# EAGLE design All_in_one Starter Kit for Arduino_V1.0 (EAGLE 9.6.2)
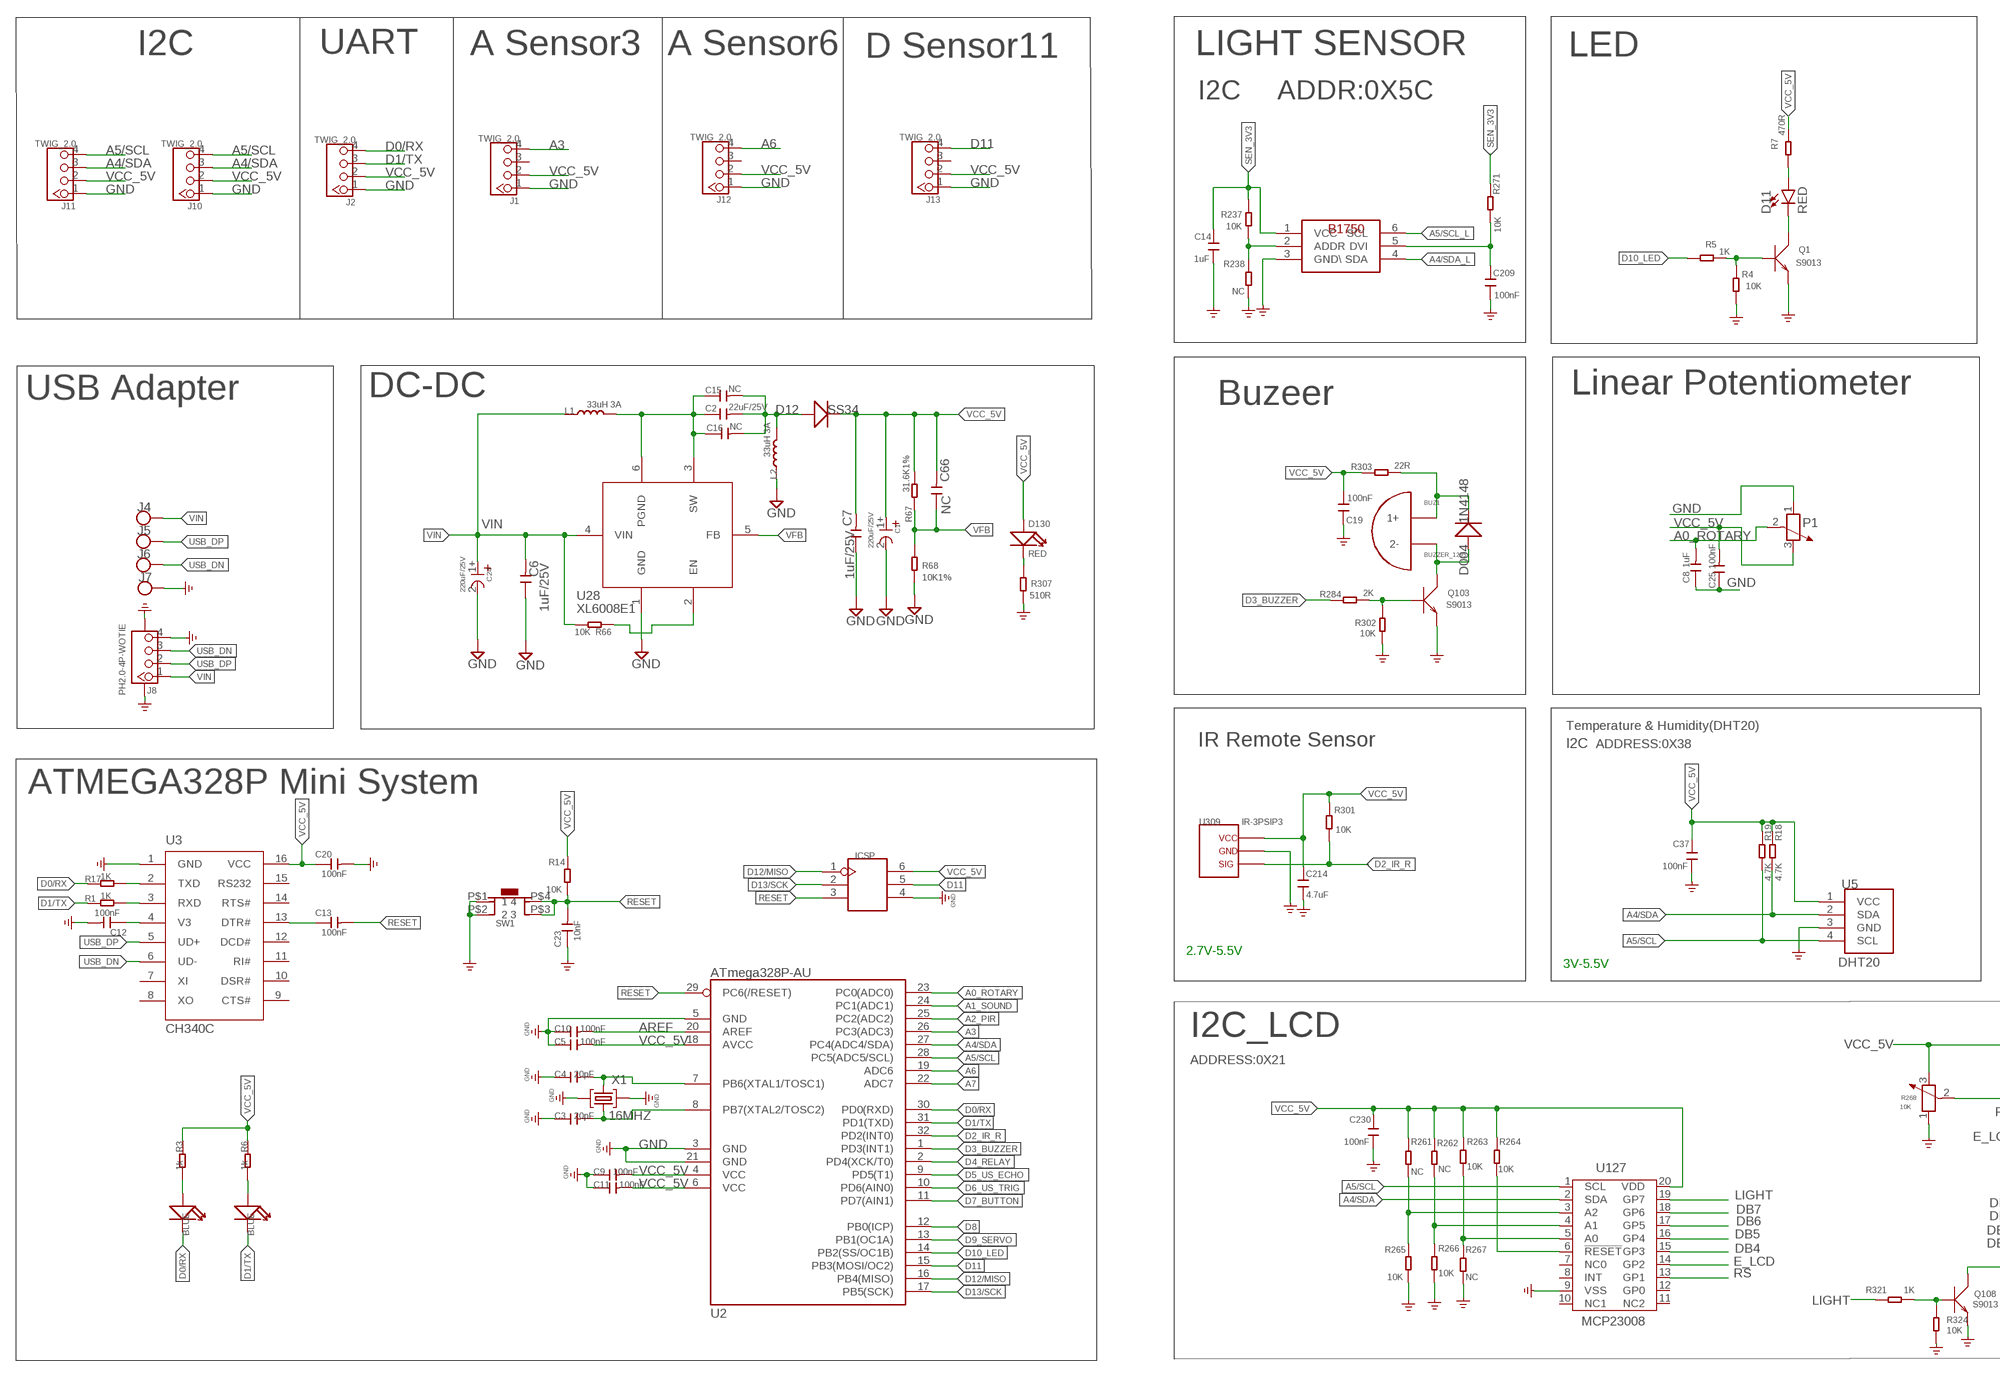
[diagram p0: schematic, sheet 1, part 1 of 2]
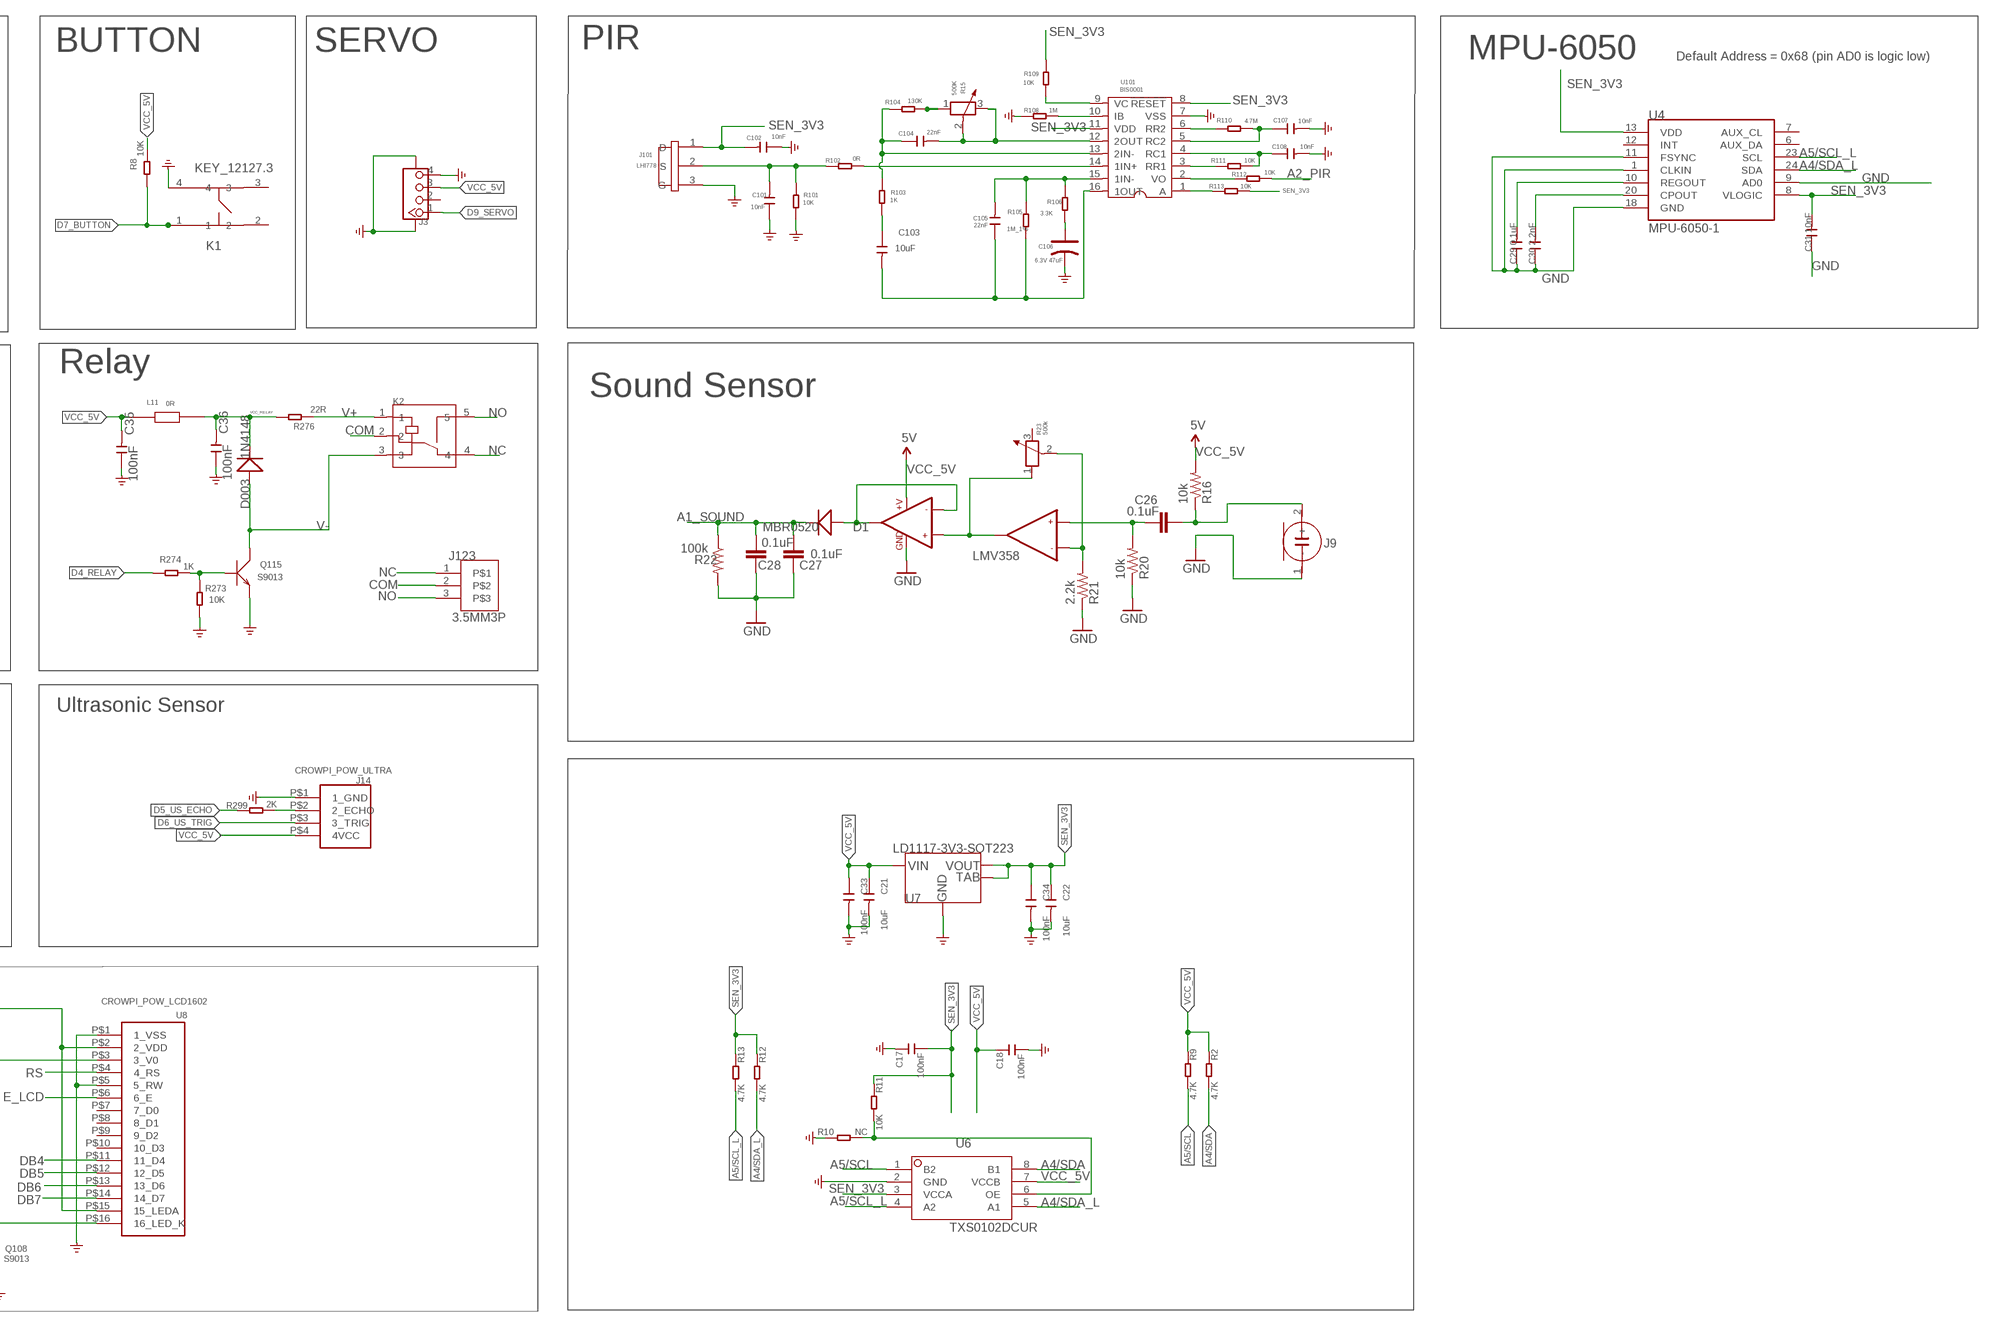
[diagram p1: schematic, sheet 1, part 2 of 2]

## Parts
BUZ1  BUZZER_1295  BUZZERBUZZER_1295_DIP  [BUZZER-D12MM-DIP2]
C1  220uF/25V  CAP_SMD_6.35.4MM  [CAP_SMD_6.3*5.4MM]
C2  22uF/25V  CAPC0805  [C0805]
C3  20pF  C-0603  [C0603]
C4  20pF  C-0603  [C0603]
C5  100nF  C-0603  [C0603]
C6  1uF/25V  C-0603  [C0603]
C7  1uF/25V  C-0603  [C0603]
C8  1uF  C-0603  [C0603]
C9  100nF  C-0603  [C0603]
C10  100nF  C-0603  [C0603]
C11  100nF  C-0603  [C0603]
C12  100nF  C0603  [C0603]
C13  100nF  C0603  [C0603]
C14  1uF  C0603  [0603]
C15  NC  CAPC0805  [C0805]
C16  NC  CAPC0805  [C0805]
C17  100nF  C0603  [0603]
C18  100nF  C0603  [0603]
C19  100nF  C0603  [0603]
C20  100nF  C0603  [C0603]
C21  10uF  CAP  [C0603]
C22  10uF  CAP  [C0603]
C23  10nF  C0603  [C0603]
C24  220uF/25V  CAP_SMD_6.35.4MM  [CAP_SMD_6.3*5.4MM]
C25  100nF  C-0603  [C0603]
C26  0.1uF  CAP0603-CAP  [0603-CAP]
C27  0.1uF  CAP0603-CAP  [0603-CAP]
C28  0.1uF  CAP0603-CAP  [0603-CAP]
C29  0.1uF  C-0603  [C0603]
C30  2.2nF  C-0603  [C0603]
C31  10nF  C-0603  [C0603]
C33  100nF  CAP  [C0603]
C34  100nF  CAP  [C0603]
C35  100nF  C-0603  [C0603]
C36  100nF  C-0603  [C0603]
C37  100nF  C0603  [0603]
C66  NC  C-0603  [C0603]
C101  10nF  C-0603  [C0603]
C102  10nF  C-0603  [C0603]
C103  10uF  C0603  [0603]
C104  22nF  C-0603  [C0603]
C105  22nF  C-0603  [C0603]
C106  6.3V 47uF  CAP-AVX-A  [AVX-A]
C107  10nF  C-0603  [C0603]
C108  10nF  C-0603  [C0603]
C209  100nF  C0603  [0603]
C214  4.7uF  C0603  [0603]
C230  100nF  C0603  [0603]
D1  MBR0520  D'MBR0520LT1'  [SOD123-2.7X1.6]
D003  1N4148  DIODE1206  [D_SOD123]
D004  1N4148  DIODE1206  [D_SOD123]
D11  RED  LED  [LED-8MM]
D12  SS34  DIODEB130L-13-F  [SMA]
D13  BLUE  LED'0603'  [LED-0603]
D14  BLUE  LED'0603'  [LED-0603]
D130  RED  LED_0603_SMT  [LED_0603_SMT]
ICSP  2.54-2x3p male  HEADER-2X3P-2.54  [2X3P-2.54]
J1  TWIG_2.0  [2.0_1X4]
J2  TWIG_2.0  [2.0_1X4]
J3  A_XBJ_CONNECTOR_TWIG-4P-2.0-SMD-FEMALE-REINFORCE90D  [A_XBJ_CONNECTOR_4P-SMD-2.0-90D]
J4  TP-SMDTP-SMD-2X4MM  [TP-SMD-2X4MM]
J5  TP-SMDTP-SMD-2X4MM  [TP-SMD-2X4MM]
J6  TP-SMDTP-SMD-2X4MM  [TP-SMD-2X4MM]
J7  TP-SMDTP-SMD-2X4MM  [TP-SMD-2X4MM]
J8  PH2.0-4P-WOTIE  [PH2.0-4P]
J9  TEMPLATE_MIC-6MM  [TEMPLATE_2P-D6MM]
J10  TWIG_2.0  [2.0_1X4]
J11  TWIG_2.0  [2.0_1X4]
J12  TWIG_2.0  [2.0_1X4]
J13  TWIG_2.0  [2.0_1X4]
J14  CROWPI_POW_ULTRA  [CROWPI_POW_ULTRA]
J101  LHI778  [3P-D8.1MM]
J123  3.5MM3P  [3.5MM*3P]
K1  KEY_12127.3  [KEY_12*12*7.3]
K2  RELAY-SRD  [REY5-6-19.1X15.5X15.3MM]
L1  33uH 3A  L  [L1040-SMD]
L2  33uH 3A  L  [L1040-SMD]
L11  0R  CMP201209UD1R0MT201209  [201209]
P1  R-POTENTIOMETER  [3P-SQUA-45.6X10X5.8H]
Q1  S9013  TRANSISTOR-NPN-SOT23  [SOT23@1]
Q103  S9013  TRANSISTOR-NPN-SOT23  [SOT23@1]
Q108  S9013  TRANSISTOR-NPN-SOT23  [SOT23@1]
Q115  S9013  TRANSISTOR-NPN-SOT23  [SOT23@1]
R1  1K  R0603  [R0603]
R2  4.7K  R0603  [R0603]
R3  1k  R-0603  [R0603]
R4  10K  R-0603  [R0603]
R5  1K  R-0603  [R0603]
R6  1k  R-0603  [R0603]
R7  470R  R-0603  [R0603]
R8  10K  R-0603  [R0603]
R9  4.7K  R0603  [R0603]
R10  NC  R0603  [R0603]
R11  10K  R0603  [R0603]
R12  4.7K  R0603  [R0603]
R13  4.7K  R0603  [R0603]
R14  10K  R0603  [R0603]
R15  500K  R-POTENTIOMETER-SMD  [3P-SMD-SQUA-3.6X3.3]
R16  10k  RESISTOR0603-RES  [0603-RES]
R17  1K  R0603  [R0603]
R18  4.7K  R0603  [R0603]
R19  4.7K  R0603  [R0603]
R20  10k  RESISTOR0603-RES  [0603-RES]
R21  2.2k  RESISTOR0603-RES  [0603-RES]
R22  100k  RESISTOR0603-RES  [0603-RES]
R23  500k  R-POTENTIOMETER-SMD  [3P-SMD-SQUA-3.6X3.3]
R66  10K  R0603  [R0603]
R67  31.6K1%  R0603  [R0603]
R68  10K1%  R0603  [R0603]
R101  10K  R-0603  [R0603]
R102  0R  R-0603  [R0603]
R103  1K  R-0603  [R0603]
R104  130K  R-0603  [R0603]
R105  1M_1%  R-0603  [R0603]
R106  3.3K  R-0603  [R0603]
R108  1M  R-0603  [R0603]
R109  10K  R-0603  [R0603]
R110  4.7M  R-0603  [R0603]
R111  10K  R-0603  [R0603]
R112  10K  R-0603  [R0603]
R113  10K  R-0603  [R0603]
R237  10K  R0603  [R0603]
R238  NC  R0603  [R0603]
R261  NC  R0603  [R0603]
R262  NC  R0603  [R0603]
R263  10K  R0603  [R0603]
R264  10K  R0603  [R0603]
R265  10K  R0603  [R0603]
R266  10K  R0603  [R0603]
R267  NC  R0603  [R0603]
R268  10K  R-POTENTIOMETER-SMD  [3P-SMD-SQUA-3.6X3.3]
R271  10K  R0603  [R0603]
R273  10K  R-0603  [R0603]
R274  1K  R-0603  [R0603]
R276  22R  R-0603  [R0603]
R284  2K  R0603  [R0603]
R299  2K  R0603  [R0603]
R301  10K  R0603  [R0603]
R302  10K  R0603  [R0603]
R303  22R  R0603  [R0603]
R307  510R  R0603  [R0603]
R321  1K  R0603  [R0603]
R324  10K  R0603  [R0603]
SW1  BUTTON-4P-SMD4.2X3.2  [BUTTON-SMD4P-4.2X3.2X2.5]
U1  LMV358  [SO08]
U2  ATmega328P-AU  ATMEGA168  [TQFP32]
U3  CH340C  CH340G  [SOP-16]
U4  MPU-6050-1  [QFN-24-4MM2]
U5  DHT20  CROWTAIL-DHT20-V1.0-20211013_DHT20  [CROWTAIL-DHT20-V1.0-20211013_DHT20]
U6  TXS0102DCUR  [VSSOP-8]
U7  LD1117-3V3-SOT223  [SOT223]
U8  CROWPI_POW_LCD1602  [CROWPI_POW_LCD1206]
U28  XL6008E1  XL6008XL6008  [TO252-5]
U101  BIS0001  TM2291  [SOP16]
U121  BH1750  [BH1750-WSOF-6]
U127  MCP23008  [SSOP20]
U309  IR-3PSIP3  [VS1838B-SIP3]
X1  16MHZ  CRYSTAL-3.2-2.5  [CRYSTAL-3.2-2.5]

## Nets
A0_ROTARY: C8.2 P1.2 U2.23(PC0(ADC0))
A1_SOUND: C27.2 C28.2 D1.2(-) R22.1 U2.24(PC1(ADC1))
A2_PIR: R112.1 U2.25(PC2(ADC2))
A3: J1.4 U2.26(PC3(ADC3))
A4/SDA: J10.3 J11.3 R2.2 R18.2 U2.27(PC4(ADC4/SDA)) U5.2(SDA) U6.8(B1) U127.2(SDA)
A4/SDA_L: R12.2 U4.24(SDA) U6.5(A1) U121.4(SDA)
A5/SCL: J10.4 J11.4 R9.2 R19.2 U2.28(PC5(ADC5/SCL)) U5.4(SCL) U6.1(B2) U127.1(SCL)
A5/SCL_L: R13.2 U4.23(SCL) U6.4(A2) U121.6(SCL)
A6: J12.4 U2.19(ADC6)
A7: U2.22(ADC7)
AREF: C10.2 U2.20(AREF)
COM: J123.2 K2.2
D0/RX: D13.- J2.4 R17.1 U2.30(PD0(RXD))
D1/TX: D14.- J2.3 R1.1 U2.31(PD1(TXD))
D2_IR_R: R301.2 U2.32(PD2(INT0)) U309.3
D3_BUZZER: R284.1 U2.1(PD3(INT1))
D4_RELAY: R274.2 U2.2(PD4(XCK/T0))
D5_US_ECHO: R299.2 U2.9(PD5(T1))
D6_US_TRIG: J14.P$3(3_TRIG) U2.10(PD6(AIN0))
D7_BUTTON: K1.1 R8.2 U2.11(PD7(AIN1))
D8: U2.12(PB0(ICP))
D9_SERVO: J3.1 U2.13(PB1(OC1A))
D10_LED: R5.2 U2.14(PB2(SS/OC1B))
D11: ICSP.5 J13.4 U2.15(PB3(MOSI/OC2))
D12/MISO: ICSP.1 U2.16(PB4(MISO))
D13/SCK: ICSP.2 U2.17(PB5(SCK))
DB4: U8.P$11(11_D4) U127.15(GP3)
DB5: U8.P$12(12_D5) U127.16(GP4)
DB6: U8.P$13(13_D6) U127.17(GP5)
DB7: U8.P$14(14_D7) U127.18(GP6)
E_LCD: U8.P$6(6_E) U127.14(GP2)
GND: C1.2- C3.1 C4.1 C5.1 C6.1 C7.1 C8.1 C9.1 C10.1 C11.1 C12.2 C14.1 C17.2 C18.1 C19.2 C20.2 C21.2 C22.2 C23.1 C24.2- C25.1 C27.1 C28.1 C29.1 C30.1 C31.1 C33.2 C34.2 C35.1 C36.1 C37.1 C101.1 C102.1 C106.- C107.2 C108.2 C209.1 C214.1 C230.1 ICSP.4 J1.1 J2.1 J3.4 J3.SS1 J3.SS2 J7.1 J8.4 J8.5(SS1) J8.6(SS2) J9.1(-) J10.1 J11.1 J12.1 J13.1 J14.P$1(1_GND) J101.3(G) K1.4 L2.1 P1.1 Q1.2(E) Q103.2(E) Q108.2(E) Q115.2(E) R4.1 R10.1 R20.1 R21.1 R22.2 R68.2 R101.1 R108.1 R238.1 R265.2 R266.2 R267.1 R268.1 R273.1 R302.1 R307.2 R324.2 SW1.P$1 SW1.P$2 U1.4(GND) U2.3(GND) U2.5(GND) U2.21(GND) U3.1(GND) U4.1(CLKIN) U4.9(AD0) U4.11(FSYNC) U4.18(GND) U5.3(GND) U6.2(GND) U7.1(GND) U8.P$1(1_VSS) U8.P$5(5_RW) U28.1(GND) U101.7(VSS) U121.3(GND\) U127.9(VSS) U309.2 X1.2(GND) X1.4(GND) ; supply symbol labelled POWER-OR-GND-_GND_POWER
LIGHT: R321.2 U127.19(GP7)
N$1: R111.1 U101.3(RR1)
N$2: Q108.1(B) R321.1 R324.1
N$3: R261.1 R265.1 U127.3(A2)
N$4: R262.1 R266.1 U127.4(A1)
N$5: R263.2 R267.2 U127.5(A0)
N$6: R264.2 U127.6(!RESET)
N$7: R268.2 U8.P$3(3_V0)
N$8: D13.+ R3.2
N$9: C12.1 U3.4(V3)
N$10: C13.1 U3.13(DTR#)
N$11: C4.2 U2.7(PB6(XTAL1/TOSC1)) X1.3(C2)
N$12: C3.2 U2.8(PB7(XTAL2/TOSC2)) X1.1(C1)
N$13: C108.1 R111.2 U101.4(RC1)
N$14: Q1.1(B) R4.2 R5.1
N$15: D11.2(C) Q1.3(C)
N$16: D11.1(A) R7.2
N$17: D14.+ R6.2
N$18: R66.1 U28.2(EN)
N$19: C2.2 C15.2 C16.2 D12.2(+) L2.2
N$20: Q108.3(C) U8.P$16(16_LED_K)
N$21: R112.2 U101.2(VO)
N$22: R17.2 U3.2(TXD)
N$23: R1.2 U3.3(RXD)
N$24: R10.2 R11.2 U6.6(OE)
N$25: R110.2 U101.6(RR2)
N$26: C107.1 R110.1 U101.5(RC2)
N$27: C104.2 R15.2 R15.3 U101.12(2OUT)
N$28: C104.1 R103.2 R104.2 U101.13(2IN-)
N$29: R109.2 U101.9(VC)
N$30: R108.2 U101.10(IB)
N$31: C101.2 J101.2(S) R101.2 R102.2
N$32: C103.2 C105.1 R105.1 U101.16(1OUT)
N$33: C105.2 R105.2 R106.2 U101.15(1IN-)
N$34: C209.2 R271.2 U121.5(DVI)
N$35: C103.1 R103.1
N$36: C106.+ R106.1
N$37: R113.2 U101.1(A)
N$38: R102.1 U101.14(1IN+)
N$39: R15.1 R104.1
N$40: C26.1 J9.2(+) R16.1
N$41: C26.2 R20.2 U1.5(+IN2)
N$42: R21.2 R23.2 U1.6(-IN2)
N$43: D1.1(+) U1.1(OUT1) U1.2(-IN1)
N$44: R23.1 U1.3(+IN1) U1.7(OUT2)
N$45: C29.2 U4.10(REGOUT)
N$46: C30.2 U4.20(CPOUT)
N$65: D130.2(2_K) R307.1
N$204: C2.1 C15.1 C16.1 L1.2 U28.3(SW) U28.6(PGND)
N$258: R237.1 R238.2 U121.2(ADDR)
N$259: Q115.1(B) R273.2 R274.1
N$278: J14.P$2(2_ECHO) R299.1
N$279: Q103.1(B) R284.2 R302.2
N$280: BUZ1.2(2-) D004.+ Q103.3(C)
N$281: BUZ1.1(1+) D004.- R303.2
NC: J123.1 K2.4
NO: J123.3 K2.5
RESET: C13.2 C23.2 ICSP.3 R14.2 SW1.P$3 SW1.P$4 U2.29(PC6(/RESET))
RS: U8.P$4(4_RS) U127.13(GP1)
SEN_3V3: C14.2 C17.1 C22.1 C31.2 C34.1 C102.2 J101.1(D) R11.1 R12.1 R13.1 R109.1 R113.1 R237.2 R271.1 U4.8(VLOGIC) U4.13(VDD) U6.3(VCCA) U7.2(VOUT) U7.4(TAB) U101.8(!RESET) U101.11(VDD) U121.1(VCC)
USB_DN: J6.1 J8.3 U3.6(UD-)
USB_DP: J5.1 J8.2 U3.5(UD+)
V+: K2.1 R276.2
V-: D003.+ K2.3 Q115.3(C)
VCC_5V: C1.1+ C5.2 C7.2 C9.2 C11.2 C18.2 C19.1 C20.1 C21.1 C25.2 C33.1 C35.2 C37.2 C66.2 C214.2 C230.2 D12.1(-) D130.1(1_A) ICSP.6 J1.2 J2.2 J3.3 J10.2 J11.2 J12.2 J13.2 J14.P$4(4VCC) L11.1 P1.3 R2.1 R3.1 R6.1 R7.1 R8.1 R9.1 R14.1 R16.2 R18.1 R19.1 R67.1 R261.2 R262.2 R263.1 R264.1 R268.3 R301.1 R303.1 U1.8(+V) U2.4(VCC) U2.6(VCC) U2.18(AVCC) U3.16(VCC) U5.1(VCC) U6.7(VCCB) U7.3(VIN) U8.P$2(2_VDD) U8.P$15(15_LEDA) U127.20(VDD) U309.1 ; supply symbol labelled 5V
VCC_RELAY: C36.2 D003.- L11.2 R276.1
VFB: C66.1 R67.2 R68.1 U28.5(FB)
VIN: C6.2 C24.1+ J4.1 J8.1 L1.1 R66.2 U28.4(VIN)
Unconnected: J1.3 J3.2 J12.3 J13.3 K1.2 K1.3 R23.3 U3.7(XI) U3.8(XO) U3.9(CTS#) U3.10(DSR#) U3.11(RI#) U3.12(DCD#) U3.14(RTS#) U3.15(RS232) U4.6(AUX_DA) U4.7(AUX_CL) U4.12(INT) U8.P$7(7_D0) U8.P$8(8_D1) U8.P$9(9_D2) U8.P$10(10_D3) U127.7(NC0) U127.8(INT) U127.10(NC1) U127.11(NC2) U127.12(GP0)

## Notes on the sheet
- I2C | UART | A Sensor3 | A Sensor6 | D Sensor11 | LIGHT SENSOR | LED | BUTTON | SERVO | PIR | MPU-6050
- Default Address = 0x68 (pin AD0 is logic low)
- I2C | ADDR:0X5C
- DC-DC | Linear Potentiometer | Relay
- USB Adapter | Buzeer
- Sound Sensor
- LMV358
- Temperature & Humidity(DHT20)
- Ultrasonic Sensor
- IR Remote Sensor | I2C | ADDRESS:0X38
- ATMEGA328P Mini System
- 2.7V-5.5V
- 3V-5.5V
- I2C_LCD
- ADDRESS:0X21

## Library data of the parts
BUZ1 = Crowtail_Starter:BUZZER
C1 C24 = Crowtail_Starter:CAP_SMD_6.3*5.4MM
C2 C15 C16 = CrowPanel_Advance_HMI:CAP*
C3-C5 C8-C11 C25 C29-C31 C35 C36 C101 C102 C104 C105 C107 C108 = Discrete:C*: Ceramic Capacitors
C6 C7 C66 = discrete:C*: Ceramic Capacitors
C12 C13 C20 C23 = Lora_Basic_Gateway_ Module:C0603
C14 C17-C19 C37 C209 C214 C230 = cooper:C0603
C21 C22 C33 C34 = LoraWAN_Gateway_Mainboard:CAP*
C26-C28 = SparkFun:CAP: Capacitor Standard 0603 ceramic capacitor, and 0.1" leaded capacitor.
C103 = A_xbj:C0603
C106 = Discrete:CAP*: Electrolytic Capacitors,Tantalum Capacitors and Super Capacitors
D1 = Discrete:D*
D003 D004 D12 = Crowtail_Starter:DIODE*
D11 = Crowtail_Starter:LED: LED (Generic) Standard schematic elements and footprints for 5mm, 3mm, 1206, and 0603 sized LEDs. Generic LEDs with no color specified.
D13 D14 = Discrete:LED*
D130 = cooper:LED_0603_SMT
ICSP = Connector:HEADER-2X3P
J1 J2 J10-J13 = CONNECTER:TWIG_2.0
J3 = CrowPanel ESP32 Display-4.3-inch-V2.1-20240314:A_XBJ_CONNECTOR_TWIG-4P-2.0-SMD-FEMALE-REINFORCE
J4-J7 = Crowtail_Starter:TP-SMD
J8 = CrowPanel ESP32 Display-4.3-inch-V2.1-20240314:PH2.0-4P-WOTIE
J9 = Crowtail- Sound Sensor-V2.0-20190717-01:TEMPLATE_MIC-6MM
J14 = Crowtail_Starter_V0.2:CROWPI_POW_ULTRA
J101 = PIR_motion_sensor:LHI778: Pyroelectric Infrared Detectors
J123 = Crowtail_Starter:3.5MM*3P
K1 = WGH:KEY_12*12*7.3
K2 = Discrete-new:RELAY-SRD
L1 L2 = Crowtail_Starter:L*
L11 = CrowPi2-MB-V1.4-20211012:CMP201209UD1R0MT
P1 R15 R23 R268 = Discrete:R-POTENTIOMETER*: Potentiometer
Q1 Q103 Q108 Q115 = Discrete:TRANSISTOR-NPN*: NPN audion
R1 R17 = Lora_Basic_Gateway_ Module:R0603
R2 R9-R14 R18 R19 R66-R68 R237 R238 R261-R267 R271 R284 R299 R301-R303 R307 R321 R324 = cooper:R0603
R3-R8 R101-R106 R108-R113 R273 R274 R276 = Discrete:R*
R16 R20-R22 = SparkFun:RESISTOR: Resistor Basic schematic elements and footprints for 0603, 1206, and PTH resistors.
SW1 = LoraWAN_Gateway_Mainboard:BUTTON-4P-SMD4.2X3.2
U1 = SparkFun:LMV358
U2 = IC:ATMEGA168
U3 = Lora_Basic_Gateway_ Module:CH340G
U4 = Testing:MPU-6050
U5 = Crowtail_Starter:CROWTAIL-DHT20-V1.0-20211013_DHT20
U6 = WGH:TXS0102DCUR
U7 = Lora_Basic_Gateway_ Module:LD1117-3V3-SOT223
U8 = Crowtail_Starter_V0.2:CROWPI_POW_LCD1602
U28 = Crowtail_Starter:XL6008
U101 = PIR_motion_sensor:TM2291: Infrared signal processor
U121 = Crowtail_Starter:BH1750
U127 = IC:MCP23008
U309 = Crowtail_Starter:IR-3P
X1 = SmartPrj:CRYSTAL-3.2-2.5

## Net classes
0 default: width 0.254 mm, drill 0.3 mm, clearance 0.152 mm

## Board
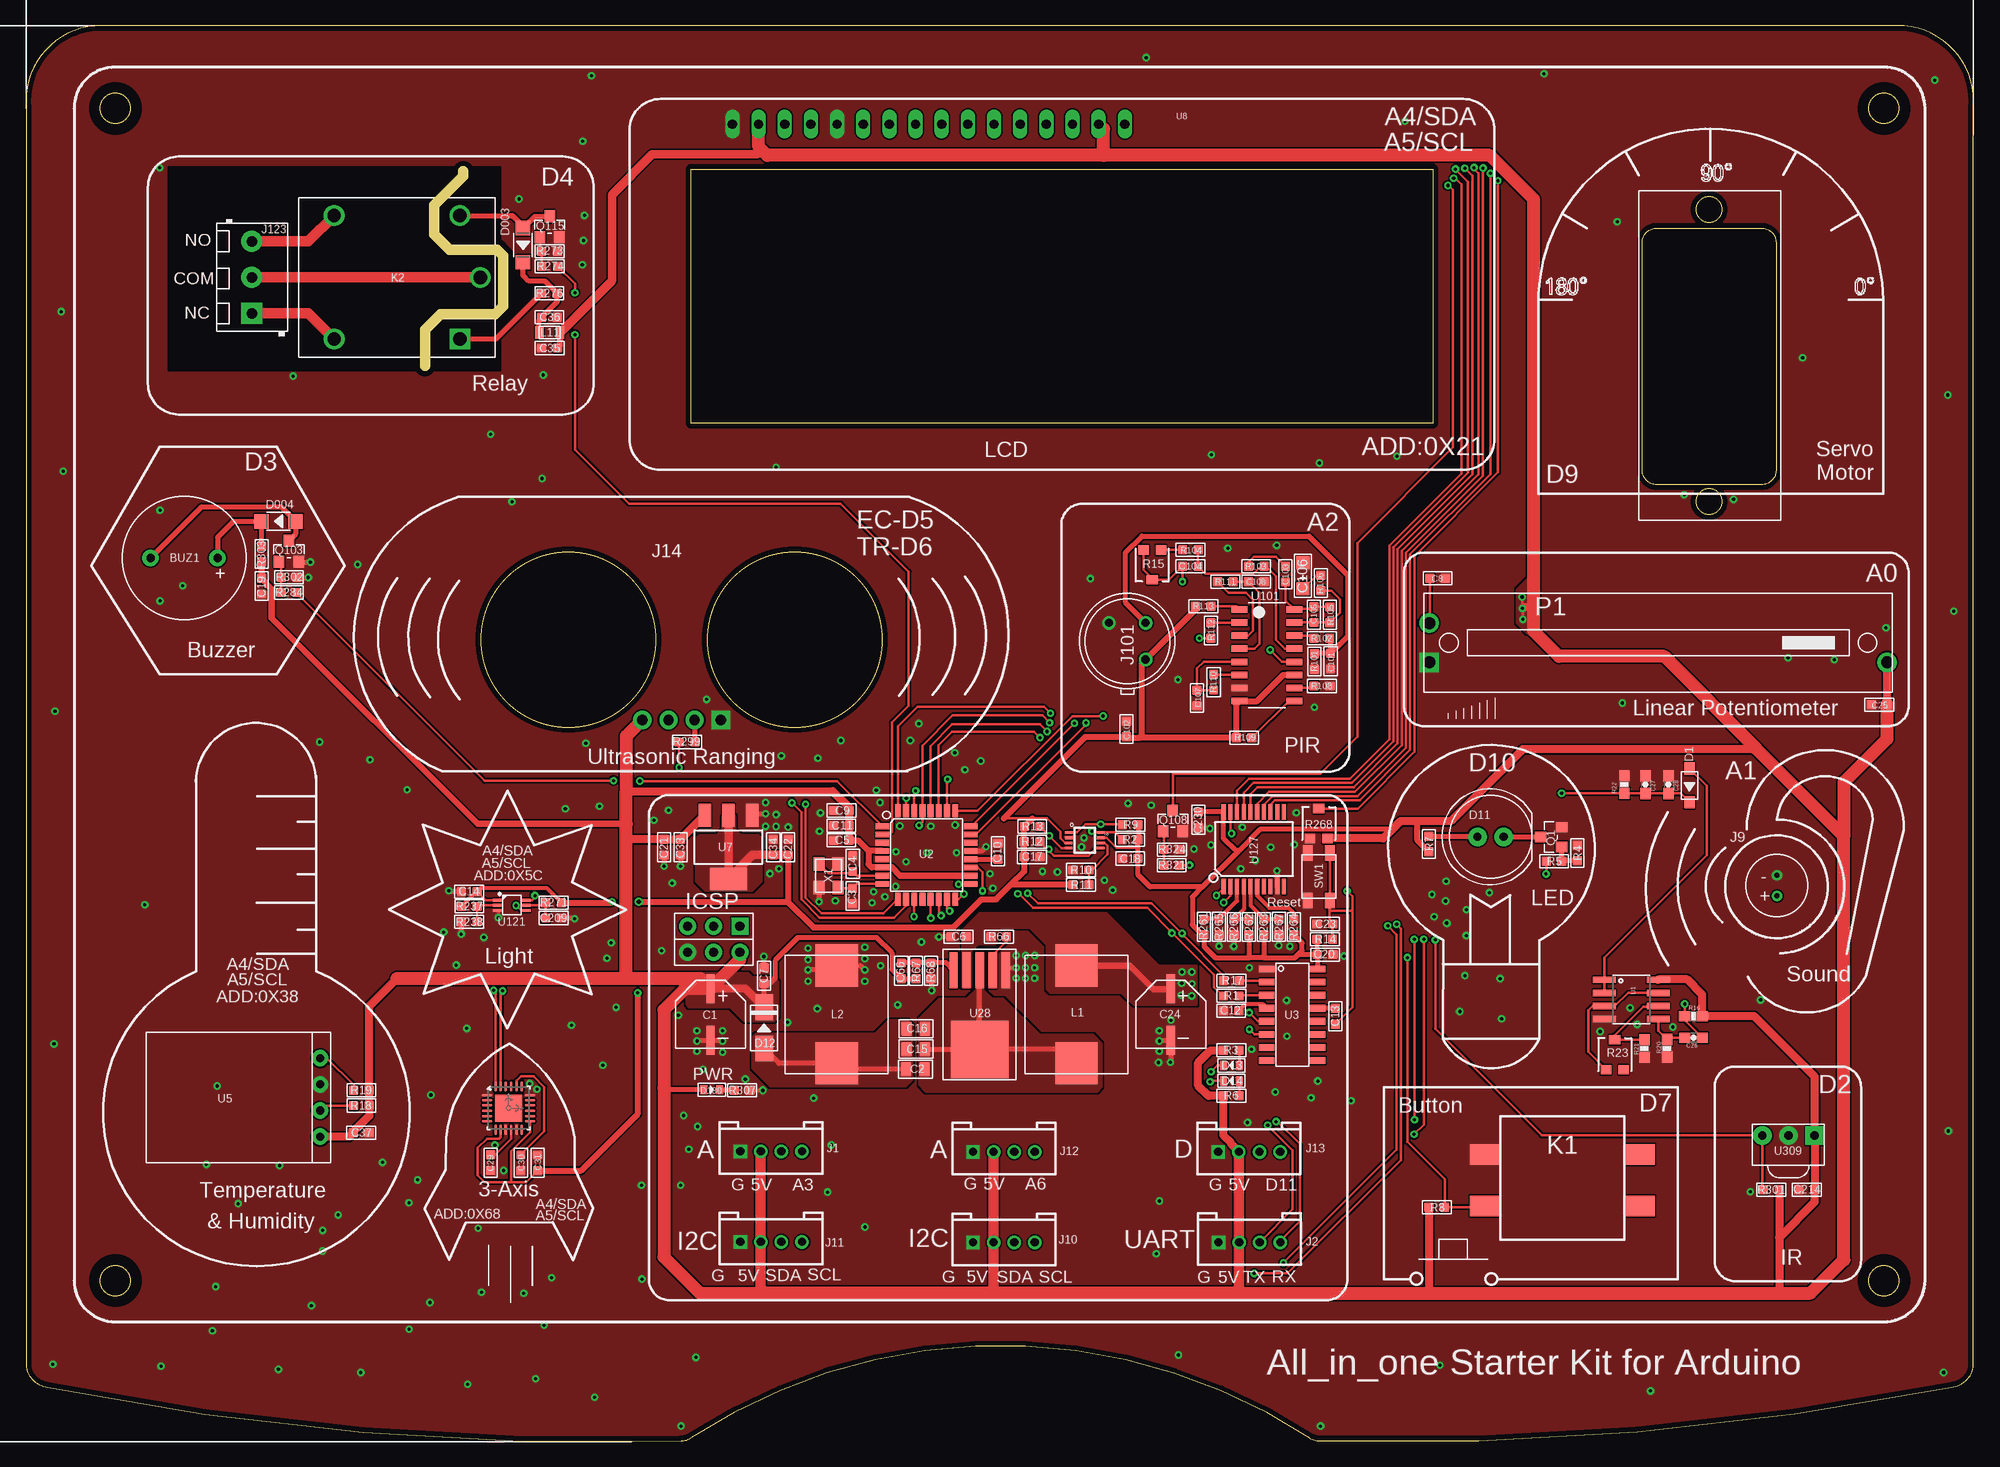
[diagram p2: board, top side]
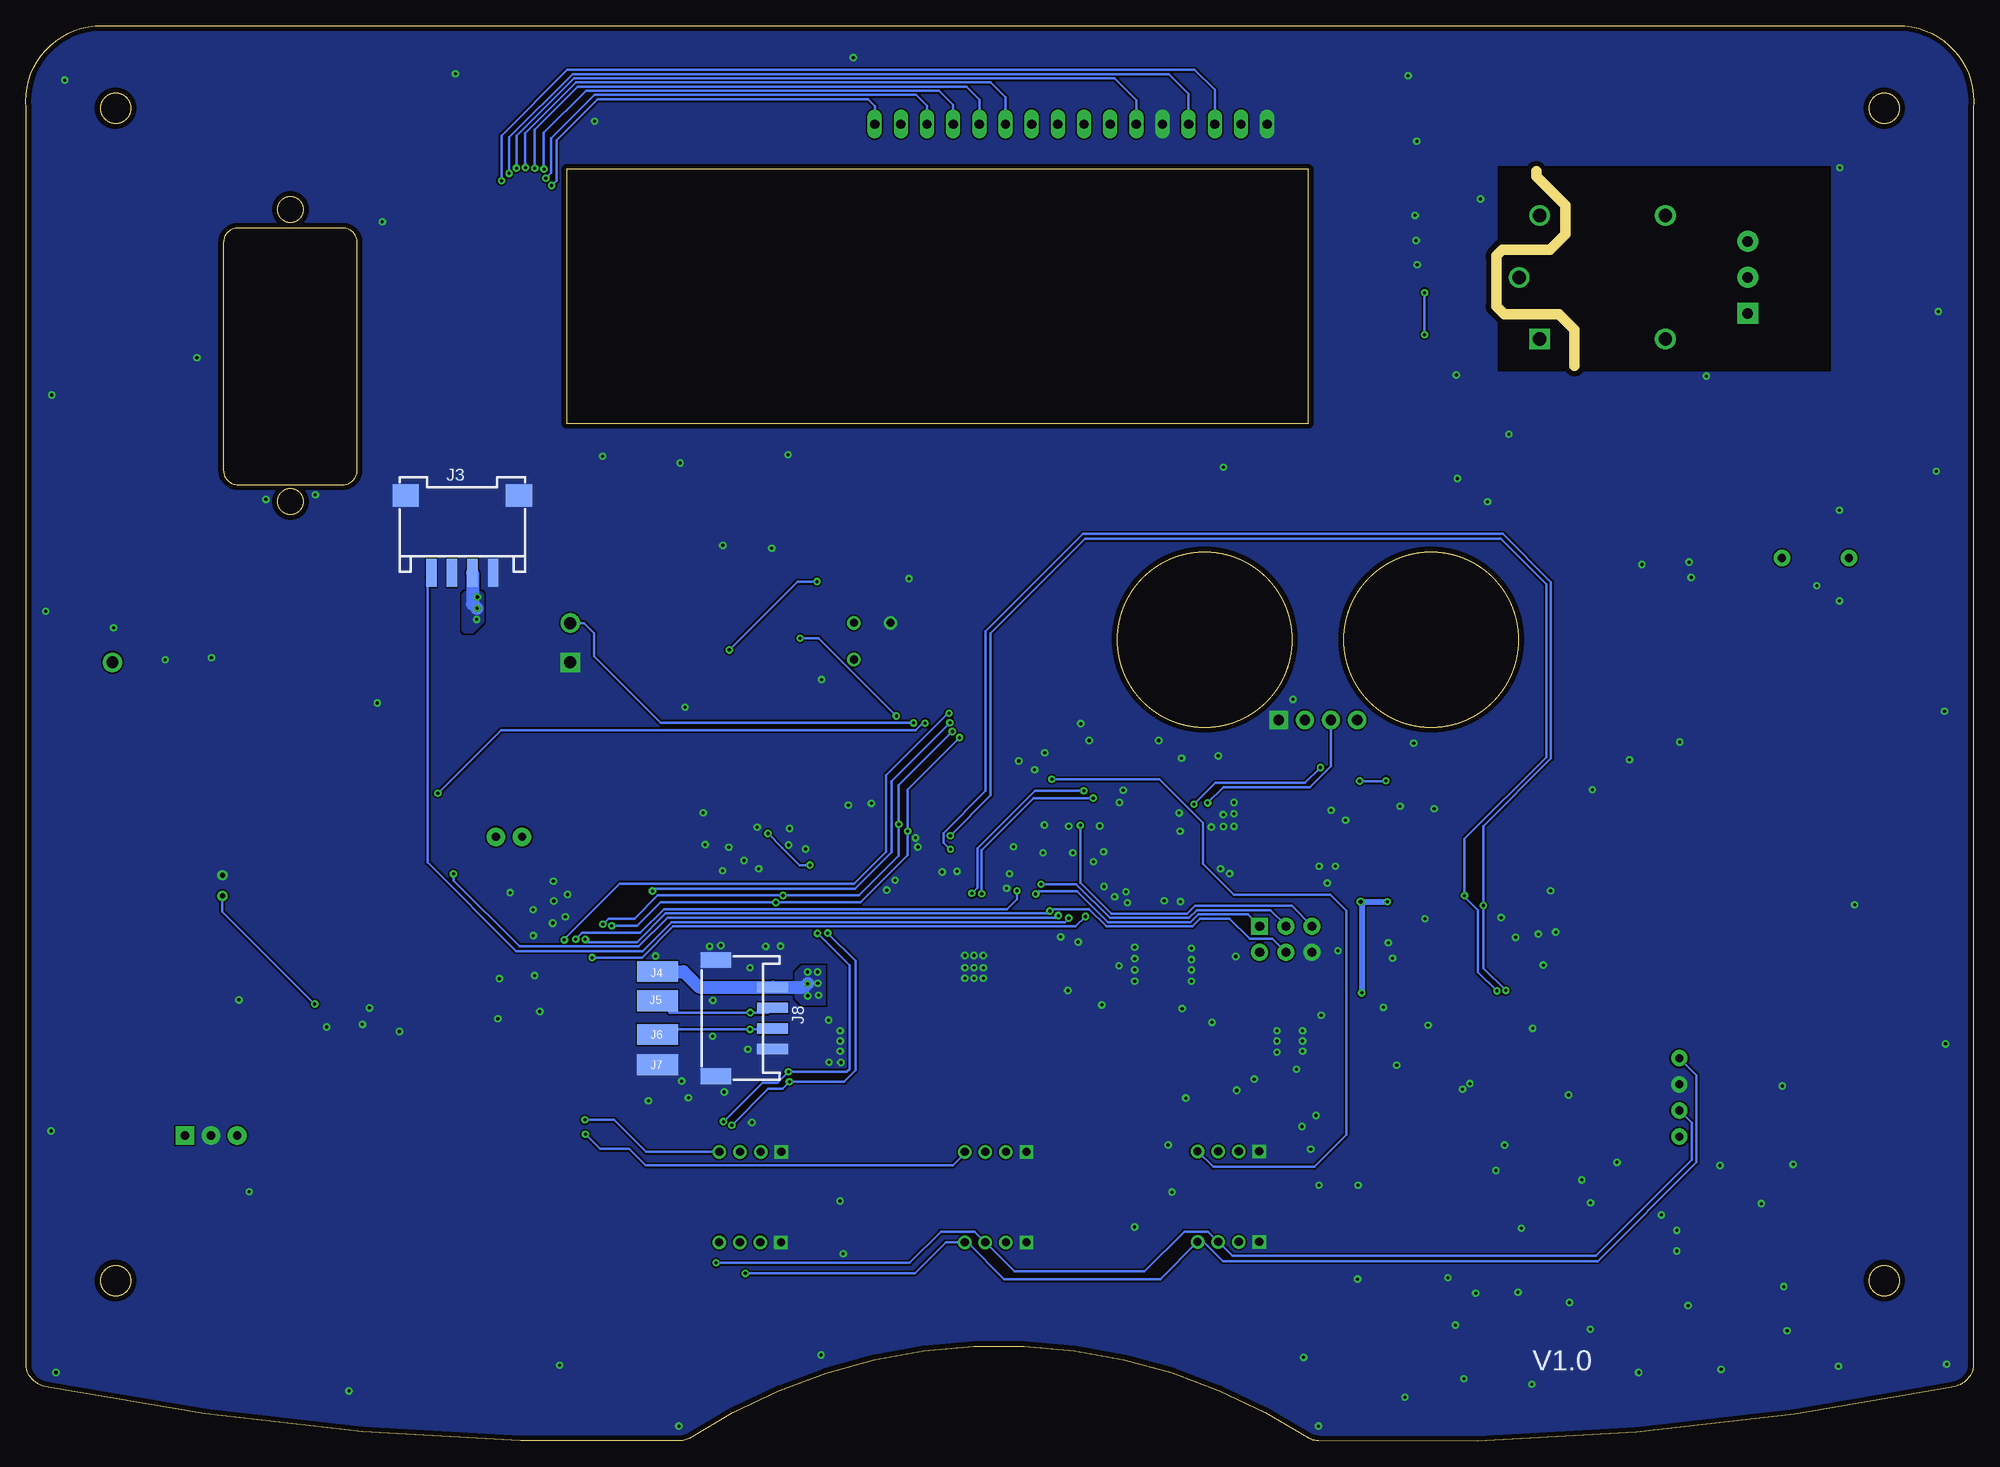
[diagram p3: board, bottom side, seen from below]

Size 189.18 x 137.4 mm. Coordinates in mm from the lower left corner, seen from the top.
Outline: 38.78,104.37 38.78,107.87 40.28,109.37 45.48,109.37
Outline: 46.38,115.07 45.78,115.67 41.18,115.67 39.68,117.17 39.68,119.97 42.48,122.77 42.48,123.27
Outline: 46.38,114.97 46.38,110.17 45.58,109.37
Outline: 189.15,7.17 189.15,129.4 arc90 182.45,137.4 6.69,137.4 arc90 0.03,129.4 0.03,7.17 arc74 2.16,5.24 arc13 63.64,0.02 arc30 64.63,0.3 arc-66 124.69,0.28 arc30 125.69,0.02 arc13 186.99,5.24 arc74 189.15,7.17
Outline: 169.98,116.35 169.98,94.25 arc-90 168.58,92.85 158.38,92.85 arc-90 156.98,94.25 156.98,116.35 arc-90 158.38,117.75 168.58,117.75 arc-90 169.98,116.35
Outline: circle at 8.69,15.58 radius 1.45
Outline: circle at 8.69,129.39 radius 1.45
Outline: circle at 180.45,15.58 radius 1.45
Outline: circle at 180.45,129.39 radius 1.45
Outline: circle at 163.48,91.2 radius 1.25
Outline: circle at 163.48,119.56 radius 1.25
Copper layers (1*16): Top 0.035mm / dielectric 1.5mm / Bottom 0.035mm
Design rules "default *": minimum track width 6mil, minimum drill 0.3mm, track to track 6mil, track to pad 6mil, pad to pad 6mil, via to via 6mil, smd to smd 6mil, copper to edge 20mil, drill to drill 6mil, minimum pad ring 10mil, minimum via ring 8mil, stop-mask expansion 4mil, vias tented up to drill 100mil, thermal gap 10mil
tKeepout: area 146.8,94 to 180.4,127.6
tRestrict: area 6.2,13.1 to 11.2,18.1; area 6.2,126.9 to 11.2,131.9; area 177.9,13.1 to 182.9,18.1; area 177.9,126.9 to 182.9,131.9

### Footprints (pad centres in the part's own frame; a part is rotated, then mirrored left to right if it is on the bottom)
BUZZER-D12MM-DIP2 = drill 0.8 pad 1.6: 1 -3.25,0; 2 3.25,0
CAP_SMD_6.3*5.4MM = smd 0.8 x 2.8: 1+ 0,2.5; 2- 0,-2.5
C0805 = smd 1.016 x 1.397: 1 -0.889,0; 2 0.889,0
C0603 = smd 0.889 x 0.889: 1 -0.762,0; 2 0.762,0
0603 = smd 0.889 x 0.889: 1 -0.762,0; 2 0.762,0
0603-CAP = smd 1.1 x 1: 1 -0.85,0; 2 0.85,0
AVX-A = smd 1.27 x 1.27: + -1.27,0; - 1.27,0
SOD123-2.7X1.6 = smd 1.2 x 1.02: 1 -1.635,0; 2 1.635,0
D_SOD123 = smd 1.397 x 1.397: + -1.651,0; - 1.651,0
LED-8MM = drill 0.8 pad 1.8: 1 -1.27,0; 2 1.27,0
SMA = smd 2.5 x 1.7: 1 2,0; 2 -2,0
LED-0603 = smd 0.762 x 0.889: + -0.762,0; - 0.762,0
LED_0603_SMT = smd 0.762 x 0.889: 1 -0.762,0; 2 0.762,0
2X3P-2.54 = drill 0.889 pad 1.651 square: 1 -1.27,2.54 | drill 0.889 pad 1.651: 2 -1.27,0; 3 -1.27,-2.54; 4 1.27,-2.54; 5 1.27,0; 6 1.27,2.54
2.0_1X4 = drill 0.8 pad 1.27 square: 1 -3,0 | drill 0.8 pad 1.27: 2 -1,0; 3 1,0; 4 3,0
A_XBJ_CONNECTOR_4P-SMD-2.0-90D = smd 1.01 x 2.74: 1 -3,-0.1; 2 -1,-0.1; 3 1,-0.1; 4 3,-0.1 | smd 2.54 x 2.184: SS1 -5.5,7.4; SS2 5.5,7.4
TP-SMD-2X4MM = smd 4 x 2: 1 0,0
PH2.0-4P = smd 1 x 3: 1 -3,2.762; 2 -1,2.762; 3 1,2.762; 4 3,2.762 | smd 1.524 x 3: 5 -5.65,-2.763; 6 5.65,-2.763
TEMPLATE_2P-D6MM = drill 0.5 pad 0.9: 1 0,1; 2 0,-1
CROWPI_POW_ULTRA = drill 1 pad 1.778 square: P$1 3.81,0 | drill 1 pad 1.778: P$2 1.27,0; P$3 -1.27,0; P$4 -3.81,0
3P-D8.1MM = drill 0.8: 1 1.778,1.778; 2 -1.778,1.778; 3 -1.778,-1.778
3.5MM*3P = drill 1.016 pad 2.032 square: 1 -3.5,0 | drill 1.016 pad 2.032: 2 0,0; 3 3.5,0
KEY_12*12*7.3 = smd 3 x 2: 1 -7.5,-2.5; 2 7.5,-2.5; 3 7.5,2.5; 4 -7.5,2.5
REY5-6-19.1X15.5X15.3MM = drill 1.3 pad 2 square: 1 -6.1,6 | drill 1.3 pad 2: 2 -8.1,0; 3 -6.1,-6; 4 6.1,6; 5 6.1,-6
L1040-SMD = smd 4.1 x 4.1: 1 -4.75,0; 2 4.75,0
201209 = smd 0.8 x 1.2: 1 -1,0; 2 1,0
3P-SQUA-45.6X10X5.8H = drill 1.143 pad 1.905 square: 1 -22.225,-1.905 | drill 1.143 pad 1.905: 2 -22.225,1.905; 3 22.225,-1.905
SOT23@1 = smd 1.016 x 1.143: 1 -0.95,-1.016; 2 0.95,-1.016; 3 0,1.016
R0603 = smd 0.889 x 0.889: 1 -0.762,0; 2 0.762,0
3P-SMD-SQUA-3.6X3.3 = smd 1 x 0.9: 1 -0.85,-1.45; 3 0.85,-1.45 | smd 1.1 x 0.9: 2 0,1.45
0603-RES = smd 1.1 x 1: 1 -0.85,0; 2 0.85,0
BUTTON-SMD4P-4.2X3.2X2.5 = smd 1.5 x 0.95: P$1 -2.3,1.075; P$2 2.3,1.075; P$3 -2.3,-1.075; P$4 2.3,-1.075
SO08 = smd 0.61 x 2.21: 1 -1.905,-2.616; 2 -0.635,-2.616; 3 0.635,-2.616; 4 1.905,-2.616; 5 1.905,2.616; 6 0.635,2.616; 7 -0.635,2.616; 8 -1.905,2.616
TQFP32 = smd 1.27 x 0.559: 1 -4.293,2.8; 2 -4.293,2; 3 -4.293,1.2; 4 -4.293,0.4; 5 -4.293,-0.4; 6 -4.293,-1.2; 7 -4.293,-2; 8 -4.293,-2.8; 17 4.293,-2.8; 18 4.293,-2; 19 4.293,-1.2; 20 4.293,-0.4; 21 4.293,0.4; 22 4.293,1.2; 23 4.293,2; 24 4.293,2.8 | smd 0.559 x 1.27: 9 -2.8,-4.293; 10 -2,-4.293; 11 -1.2,-4.293; 12 -0.4,-4.293; 13 0.4,-4.293; 14 1.2,-4.293; 15 2,-4.293; 16 2.8,-4.293; 25 2.8,4.293; 26 2,4.293; 27 1.2,4.293; 28 0.4,4.293; 29 -0.4,4.293; 30 -1.2,4.293; 31 -2,4.293; 32 -2.8,4.293
SOP-16 = smd 0.66 x 1.5: 1 -4.445,-2.475; 2 -3.175,-2.475; 3 -1.905,-2.475; 4 -0.635,-2.475; 5 0.635,-2.475; 6 1.905,-2.475; 7 3.175,-2.475; 8 4.445,-2.475; 9 4.445,2.475; 10 3.175,2.475; 11 1.905,2.475; 12 0.635,2.475; 13 -0.635,2.475; 14 -1.905,2.475; 15 -3.175,2.475; 16 -4.445,2.475
QFN-24-4MM2 = smd 1.016 x 0.254: 1 -2.066,1.257; 2 -2.066,0.75; 3 -2.066,0.247; 4 -2.066,-0.287; 5 -2.066,-0.792; 6 -2.066,-1.297; 13 2.086,-1.297; 14 2.086,-0.792; 15 2.086,-0.287; 16 2.086,0.247; 17 2.086,0.75; 18 2.086,1.257 | smd 0.254 x 1.016: 7 -1.267,-2.122; 8 -0.762,-2.122; 9 -0.258,-2.122; 10 0.278,-2.122; 11 0.78,-2.122; 12 1.287,-2.122; 19 1.287,2.082; 20 0.78,2.082; 21 0.278,2.082; 22 -0.258,2.082; 23 -0.762,2.082; 24 -1.267,2.082 | smd 2.616 x 2.616: P$1 0.02,-0.01
CROWTAIL-DHT20-V1.0-20211013_DHT20 = drill 0.8 pad 1.6: 1 -3.81,0; 2 -1.27,0; 3 1.27,0; 4 3.81,0
VSSOP-8 = smd 0.25 x 0.7: 1 -0.762,-1.55; 2 -0.254,-1.55; 3 0.254,-1.55; 4 0.762,-1.55; 5 0.762,1.55; 6 0.254,1.55; 7 -0.254,1.55; 8 -0.762,1.55
SOT223 = smd 1.219 x 2.235: 1 -2.311,-3.099; 2 0,-3.099; 3 2.311,-3.099 | smd 3.6 x 2.2: 4 0,3.099
CROWPI_POW_LCD1206 = drill 0.9 long: P$1 -16.51,3.36; P$2 -13.97,3.36; P$3 -11.43,3.36; P$4 -8.89,3.36; P$5 -6.35,3.36; P$6 -3.81,3.36; P$7 -1.27,3.36; P$8 1.27,3.36; P$9 3.81,3.36; P$10 6.35,3.36; P$11 8.89,3.36; P$12 11.43,3.36; P$13 13.97,3.36; P$14 16.51,3.36; P$15 19.05,3.36; P$16 21.59,3.36
TO252-5 = smd 3.5 x 0.8: 1 4.32,-2.53; 2 4.32,-1.26; 3 4.32,0.01; 4 4.32,1.28; 5 4.32,2.55 | smd 5.6 x 5.6: 6 -3.38,0.01
SOP16 = smd 0.635 x 1.524: 1 0,0; 2 1.27,0; 3 2.54,0; 4 3.81,0; 5 5.08,0; 6 6.35,0; 7 7.62,0; 8 8.89,0; 9 8.89,5.334; 10 7.62,5.334; 11 6.35,5.334; 12 5.08,5.334; 13 3.81,5.334; 14 2.54,5.334; 15 1.27,5.334; 16 0,5.334
BH1750-WSOF-6 = smd 0.8 x 0.27: 1 -1.4,0.5; 2 -1.4,0; 3 -1.4,-0.5; 4 1.4,-0.5; 5 1.4,0; 6 1.4,0.5
SSOP20 = smd 0.4 x 1.5: 1 -2.925,-3.625; 2 -2.275,-3.625; 3 -1.625,-3.625; 4 -0.975,-3.625; 5 -0.325,-3.625; 6 0.325,-3.625; 7 0.975,-3.625; 8 1.625,-3.625; 9 2.275,-3.625; 10 2.925,-3.625; 11 2.925,3.625; 12 2.275,3.625; 13 1.625,3.625; 14 0.975,3.625; 15 0.325,3.625; 16 -0.325,3.625; 17 -0.975,3.625; 18 -1.625,3.625; 19 -2.275,3.625; 20 -2.925,3.625
VS1838B-SIP3 = drill 0.8 pad 1.8 square: 1 -2.54,0 | drill 0.8 pad 1.8: 2 0,0; 3 2.54,0
CRYSTAL-3.2-2.5 = smd 1.3 x 1.05: 1 -1.15,-0.925; 2 1.15,-0.925; 3 1.15,0.925; 4 -1.15,0.925

### Placement (x,y rotation side)
BUZ1  15.38,85.73 180 top
C1  66.51,41.41 0 top
C2  86.39,36.09 180 top
C3  80.31,52.91 90 top
C4  80.32,56.06 270 top
C5  79.19,58.31 0 top
C6  90.6,48.96 0 top
C7  71.7,45.18 270 top
C8  137.11,83.78 180 top
C9  79.22,61.21 0 top
C10  94.43,57.26 270 top
C11  79.21,59.75 0 top
C12  117.07,41.78 180 top
C13  127.18,41.24 270 top
C14  43.07,53.34 0 top
C15  86.44,38.04 180 top
C16  86.44,40.02 180 top
C17  97.72,56.7 0 top
C18  107.26,56.55 0 top
C19  22.9,83 270 top
C20  126.19,47.23 0 top
C21  62,57.66 270 top
C22  74.05,57.66 90 top
C23  126.17,50.19 0 top
C24  111.2,41.41 0 top
C25  179.99,71.49 0 top
C26  161.96,39.15 180 top
C27  157.3,63.73 270 top
C28  159.53,63.73 270 top
C29  45.13,27.03 90 top
C30  48.08,27.01 90 top
C31  49.72,27.01 270 top
C33  63.61,57.66 270 top
C34  72.6,57.66 90 top
C35  50.87,106.12 0 top
C36  50.84,109.09 180 top
C37  32.57,29.94 180 top
C66  85.03,45.65 270 top
C101  126.73,75.71 90 top
C102  106.89,69.13 270 top
C103  122.34,84.16 270 top
C104  113.1,84.91 180 top
C105  125.11,80.23 270 top
C106  124.04,84 90 top
C107  113.75,72.14 270 top
C108  119.5,83.43 0 top
C209  51.27,50.78 180 top
C214  172.96,24.4 0 top
C230  113.87,60.3 90 top
D1  161.57,63.65 270 top
D003  48.29,116.1 270 top
D004  24.55,89.29 180 top
D11  142.25,58.66 0 top
D12  71.71,40.1 90 top
D13  117.09,36.46 180 top
D14  117.09,34.96 180 top
D130  66.62,34.09 0 top
ICSP  66.81,48.71 270 top
J1  72.38,28.13 0 top
J2  118.84,19.29 0 top
J3  146.79,84.39 0 bottom
J4  127.82,45.57 0 bottom
J5  127.82,42.74 0 bottom
J6  127.82,39.47 0 bottom
J7  127.82,36.53 0 bottom
J8  119.4,41.06 270 bottom
J9  170.06,53.93 0 top
J10  94.99,19.29 0 top
J11  72.38,19.34 0 top
J12  94.99,28.08 0 top
J13  118.81,28.08 0 top
J14  63.69,70 0 top
J101  106.97,77.66 270 top
J123  21.95,112.98 90 top
K1  KEY_1212*7.3  [KEY_12*12*7.3]  149.23,25.32 0 top
K2  36.05,112.98 180 top
L1  102.04,41.41 270 top
L2  78.76,41.41 270 top
L11  50.88,107.61 180 top
P1  158.52,77.5 0 top
Q1  148.13,58.64 90 top
Q103  25.56,86.39 0 top
Q108  111.4,60.2 0 top
Q115  50.88,117.89 0 top
R1  117.08,43.21 0 top
R2  107.25,58.37 180 top
R3  117.08,37.92 0 top
R4  150.68,57.1 270 top
R5  148.43,56.29 180 top
R6  117.08,33.51 0 top
R7  136.27,57.97 90 top
R8  137.03,22.7 0 top
R9  107.28,59.82 180 top
R10  102.47,55.44 0 top
R11  102.48,53.99 0 top
R12  97.72,58.18 0 top
R13  97.74,59.66 0 top
R14  126.16,48.71 0 top
R15  109.4,85.07 180 top
R16  161.96,41.24 0 top
R17  117.09,44.68 0 top
R18  32.59,32.57 180 top
R19  32.6,34.04 180 top
R20  159.38,38.12 90 top
R21  157.2,38.11 90 top
R22  155.25,63.74 90 top
R23  154.31,37.51 0 top
R66  94.51,48.96 180 top
R67  86.46,45.65 90 top
R68  87.9,45.65 270 top
R101  125.16,75.68 90 top
R102  125.87,77.94 0 top
R103  119.5,84.93 0 top
R104  113.12,86.52 0 top
R105  126.64,80.21 270 top
R106  125.76,83.3 270 top
R108  125.88,73.3 180 top
R109  118.33,68.26 0 top
R110  115.36,73.67 90 top
R111  116.5,83.43 0 top
R112  115.1,78.7 90 top
R113  114.37,81.03 0 top
R237  43.08,51.9 180 top
R238  43.05,50.4 0 top
R261  114.42,49.92 270 top
R262  118.79,49.9 270 top
R263  120.24,49.91 90 top
R264  123.16,49.91 90 top
R265  115.89,49.92 270 top
R266  117.34,49.91 270 top
R267  121.7,49.92 90 top
R268  125.56,59.95 0 top
R271  51.25,52.26 180 top
R273  50.86,115.53 180 top
R274  50.86,114.05 0 top
R276  50.85,111.44 180 top
R284  25.57,82.38 180 top
R299  64.22,67.86 180 top
R301  169.51,24.4 180 top
R302  25.57,83.85 180 top
R303  22.9,86.11 90 top
R307  69.58,34.06 0 top
R321  111.29,55.89 0 top
R324  111.31,57.42 0 top
SW1  125.57,54.8 90 top
U1  155.92,42.87 270 top
U2  87.48,56.89 0 top
U3  122.99,41.38 270 top
U4  46.88,32.33 0 top
U5  28.59,33.35 90 top
U6  102.85,58.32 270 top
U7  68.25,57.65 180 top
U8  85.14,124.49 0 top
U28  92.65,41.4 90 top
U101  117.87,80.73 270 top
U121  47.21,52.01 0 top
U127  119.26,57.46 0 top
U309  171.18,29.66 180 top
X1  77.96,54.88 90 top

### Tracks (layer width: path | path; a pad name or v marks a point on that pad's centre or on a via)
A0_ROTARY  (via drill 0.3)
  Top 0.254: C8.2 136.35,79.46 P1.2 | U2.23 92.29,58.89 102.95,69.55 v102.95,69.72
  Bottom 0.254: v102.95,69.72 127.51,69.72 133.98,76.19 133.98,78.42 134.97,79.41 P1.2
A1_SOUND  (via drill 0.3)
  Top 0.254: U2.24 91.86,59.69 101.84,69.67 v101.84,69.69 | D1.2 160.71,62.88 C28.2 C27.2 157.29,62.89 R22.1 v149.15,62.89
  Bottom 0.254: v101.84,69.69 102.08,69.69 102.75,69.02 142.99,69.02 149.1,62.91 149.13,62.91 v149.15,62.89
A2_PIR  (via drill 0.3)
  Top 0.254: U2.25 92.43,61.18 101.63,70.39 v104.63,70.39 | v113.98,77.94 R112.1
  Bottom 0.254: v104.63,70.39 112.18,77.94 v113.98,77.94
A3  (via drill 0.3)
  Top 0.254: U2.26 89.48,64.2 v89.53,64.25
  Bottom 0.254: v89.53,64.25 79.07,64.25 74.86,60.04 74.86,56.03 71.87,53.04 62.46,53.04 60.91,51.49 60.91,29.75 64.04,26.62 73.86,26.62 75.37,28.13 J1.4
A4/SDA  (via drill 0.3)
  Top 0.254: R2.2 105.78,59.08 U6.8 103.66,59.08 v103.53,59.21 | R18.2 29.08,32.57 U5.2 | U2.27 88.64,61.22 88.64,67.54 89.97,68.88 97.9,68.88 v98.49,68.29 | v116.34,52.29 116.99,52.94 U127.2 | v132.27,50.02 133.13,49.16 133.13,28.29 v122.14,17.3
  Bottom 0.254: v98.49,68.29 103.56,63.22 103.56,59.24 v103.53,59.21 103.53,56.87 108.11,52.29 v116.34,52.29 127.53,52.29 129.8,50.02 v132.27,50.02 | U5.2 27.39,30.88 27.39,27.31 36.72,17.97 71.99,17.97 73.35,19.34 J11.3 74.36,20.32 76.66,20.32 80.52,16.46 93.14,16.46 95.97,19.29 J10.3 97.04,20.34 100.31,20.34 103.35,17.3 v122.14,17.3
A4/SDA_L  (via drill 0.3)
  Top 0.254: 99.29,57.38 99.83,56.84 103.22,56.84 103.93,57.56 U6.5 | 99.29,57.38 R12.2 | 99.29,57.38 v99.37,57.45 | U121.4 48.1,51.51 v47.62,51.99 | v45.45,43.75 45.62,43.58 U4.24
  Bottom 0.254: v99.37,57.45 99.42,57.45 100.04,58.07 100.04,59.03 95.95,63.11 95.95,78.61 86.5,88.07 45.75,88.07 41.06,83.38 41.06,66.27 47.62,59.7 v47.62,51.99 47.62,45.92 v45.45,43.75
A5/SCL  (via drill 0.3)
  Top 0.254: R9.2 106.46,59.87 v104.4,59.87 102.89,59.87 102.1,59.08 U6.1 | R19.2 31.84,34.57 29.25,37.16 U5.4 | U2.28 87.87,61.19 87.87,67.47 89.97,69.58 98.5,69.58 v99.19,68.89 | v115.64,52.96 116.34,53.67 U127.1 | v133.14,50.17 133.14,50.11 133.53,49.72 133.53,27.27 122.53,16.27 v119.3,16.27
  Bottom 0.254: v99.19,68.89 104.43,63.65 104.43,59.9 v104.4,59.87 104.4,56.84 108.27,52.96 v115.64,52.96 127.83,52.96 130.07,50.73 132.58,50.73 v133.14,50.17 | U5.4 26.93,35.5 26.93,27.05 36.51,17.47 72.93,17.47 74.8,19.34 J11.4 78.99,15.73 94.17,15.73 97.73,19.29 J10.4 99.81,19.29 102.83,16.27 v119.3,16.27
A5/SCL_L  (via drill 0.3)
  Top 0.254: U6.4 100.6,57.56 v99.39,58.77 R13.2 | U121.6 49.18,52.51 49.45,52.78 v49.45,52.95 | U4.23 46.12,43.51 v46.31,43.7
  Bottom 0.254: v99.39,58.77 95.47,62.69 95.47,78.43 86.3,87.6 45.94,87.6 41.5,83.16 41.5,66.41 49.45,58.46 v49.45,52.95 49.45,52.84 48.14,51.53 48.14,45.52 v46.31,43.7
A6  (via drill 0.3)
  Top 0.254: U2.19 92.43,55.69 92.92,55.2 v92.92,53.41 | v135.77,48.71 135.77,30.73 v134.82,29.78
  Bottom 0.254: v92.92,53.41 92.92,52.6 93.89,51.63 127.2,51.63 129.5,49.33 134.56,49.33 134.57,49.34 135.14,49.34 v135.77,48.71 | v134.82,29.78 133.39,28.35 130.56,28.35 128.98,26.77 99.13,26.77 97.99,27.91 J12.4
AREF
  Top 0.5: U2.20 C10.2
COM
  Top 1.016: J123.2 K2.2
D0/RX  (via drill 0.3)
  Top 0.254: R17.1 116.33,45.18 112.26,49.25 | 112.26,49.25 109.31,52.2 98.28,52.2 v97.3,53.18 | U2.30 86.28,62.99 v86.42,63.13 | 112.26,49.25 v112.3,49.29 | v115.11,35.85 115.72,36.46 D13.- | v121.42,31.01 121.57,31.01 123.72,28.86 123.72,21.35 121.84,19.47 J2.4
  Bottom 0.254: v86.42,63.13 91.16,63.13 96.75,57.54 96.75,53.72 v97.29,53.18 v97.3,53.18 | v112.3,49.29 109.2,46.19 109.2,36.11 109.46,35.85 v115.11,35.85 116.17,34.78 117.64,34.78 v121.42,31.01
D1/TX  (via drill 0.3)
  Top 0.254: R1.1 116.3,43.19 115.41,44.08 115.41,45.28 111.33,49.35 | v96.34,53.14 96.44,53.14 97.8,51.77 108.91,51.77 111.33,49.35 | v85.51,62.42 85.51,61.21 U2.31 | 111.33,49.35 v111.29,49.31 | v115.02,34.88 115.1,34.96 D14.- | v120.6,30.66 123.03,28.24 123.03,22.49 J2.3
  Bottom 0.254: v96.34,53.14 96.34,57.37 91.29,62.42 v85.51,62.42 | v111.29,49.31 108.6,46.62 108.6,35.99 109.71,34.88 v115.02,34.88 115.7,34.19 117.07,34.19 v120.6,30.66
D2_IR_R  (via drill 0.3)
  Top 0.254: U2.32 84.69,61.19 84.69,69.38 86.59,71.28 98.89,71.28 v99.52,70.65 | v136.88,48.65 136.88,40.01 147.22,29.67 168.25,29.67 168.26,29.66 U309.3 168.64,24.51 R301.2
  Bottom 0.254: v99.52,70.65 99.6,70.65 105.63,64.62 105.63,57.22 108.76,54.09 131.52,54.09 136.88,48.73 v136.88,48.65
D3_BUZZER  (via drill 0.3)
  Top 0.254: U2.1 78.8,64.08 v59.64,64.08 | R284.1 26.33,82.32 44.55,64.1 v57.07,64.1 v57.08,64.11
  Bottom 0.254: v59.64,64.08 57.11,64.08 v57.08,64.11
D4_RELAY  (via drill 0.3)
  Top 0.254: R274.2 53.34,112.33 v53.34,111.49 | U2.2 83.82,58.89 84.11,59.17 84.11,69.77 85.74,71.4 85.74,84.41 79.15,91 58.59,91 53.33,96.26 v53.33,107.41 v53.34,107.41
  Bottom 0.254: v53.34,111.49 v53.34,107.41
D5_US_ECHO  (via drill 0.3)
  Top 0.254: U2.9 83.31,51.23 77.27,51.23 75.73,52.77 v75.73,61.83 | v63.45,65.39 R299.2
  Bottom 0.254: v75.73,61.83 73.66,63.9 64.94,63.9 v63.45,65.39
D6_US_TRIG  (via drill 0.3)
  Top 0.254: U2.10 85.48,51.99 84.31,50.82 77.1,50.82 75.32,52.6 75.32,61.04 v74.41,61.96
  Bottom 0.254: v74.41,61.96 72.89,63.48 64.46,63.48 62.42,65.52 J14.P$3
D7_BUTTON  (via drill 0.3)
  Top 0.254: U2.11 v86.28,50.93 v86.27,50.92 | v134.17,46.93 134.17,29.05 137.79,25.42 R8.2 141.6,22.7 K1.1
  Bottom 0.254: v134.17,46.93 129.33,46.93 126.3,49.96 87.23,49.96 v86.27,50.92
D9_SERVO  (via drill 0.3)
  Top 0.254: U2.13 87.88,50.78 v87.89,50.77
  Bottom 0.254: v87.89,50.77 87.89,50.74 88.26,50.37 126.46,50.37 129.27,47.57 141.55,47.57 150.17,56.19 150.17,83.91 J3.1
D10_LED  (via drill 0.3)
  Top 0.254: U2.14 88.68,51.29 88.88,51.09 88.88,51.03 v88.9,51.01 | v147.64,55.06 v147.65,55.07 147.65,56.27 R5.2
  Bottom 0.254: v88.9,51.01 89.1,50.81 126.86,50.81 129.66,48.02 141.24,48.02 147.64,54.42 v147.64,55.06
D11  (via drill 0.3)
  Top 0.254: U2.15 89.48,51.7 v89.72,51.45 | v134.84,48.7 134.84,31.22 v134.87,31.19
  Bottom 0.254: v134.84,48.7 134.56,48.42 129.83,48.42 127.03,51.22 89.95,51.22 v89.72,51.45 89.52,51.65 85.92,51.65 84.24,49.97 75.88,49.97 75.12,50.73 72.28,50.73 70.31,48.76 68.12,48.76 ICSP.5 | v134.87,31.19 132.04,31.19 128.92,28.08 J13.4
D12/MISO  (via drill 0.3)
  Top 0.254: U2.16 90.59,52.6 v91.1,53.11
  Bottom 0.254: v91.1,53.11 90.81,53.4 87.09,53.4 84.07,50.38 76.05,50.38 75.29,51.14 70.5,51.14 ICSP.1
D13/SCK  (via drill 0.3)
  Top 0.254: U2.17 91.74,54.06 v90.58,54.06
  Bottom 0.254: v90.58,54.06 87.18,54.06 83.9,50.78 76.22,50.78 75.46,51.54 68.29,51.54 66.81,50.06 ICSP.2
DB4  (via drill 0.3)
  Top 0.254: U127.15 119.59,61.89 120.72,63.02 129.1,63.02 133.63,67.55 133.63,86.42 141.08,93.88 141.08,123.09 140.65,123.53 v140.65,123.63
  Bottom 0.254: v140.65,123.63 140.66,123.64 140.66,126.99 135.74,131.91 95.49,131.91 94.03,130.45 U8.P$11
DB5  (via drill 0.3)
  Top 0.254: U127.16 118.94,62.81 119.62,63.49 128.96,63.49 133.22,67.75 133.22,86.59 140.49,93.86 140.49,122.86 139.77,123.57 v139.74,123.57
  Bottom 0.254: v139.74,123.57 139.74,127.33 135.57,131.5 97.82,131.5 96.54,130.23 96.54,127.87 U8.P$12
DB6  (via drill 0.3)
  Top 0.254: U127.17 118.29,62.94 119.25,63.9 128.78,63.9 132.82,67.94 132.82,86.76 140.05,93.99 140.05,122.27 138.85,123.47 v138.85,123.49
  Bottom 0.254: v138.85,123.49 138.88,123.52 138.88,126.99 134.78,131.09 100.47,131.09 99.11,129.73 U8.P$13
DB7  (via drill 0.3)
  Top 0.254: U127.18 117.64,63.15 118.79,64.3 128.58,64.3 132.41,68.13 132.41,86.93 139.41,93.93 139.41,122.03 138.84,122.6 v138.67,122.6
  Bottom 0.254: v138.67,122.6 138.15,123.12 138.15,126.47 133.93,130.69 102.71,130.69 101.65,129.62 U8.P$14
E_LCD  (via drill 0.3)
  Top 0.254: U127.14 120.24,61.78 121.07,62.61 129.33,62.61 134.03,67.32 134.03,86.26 141.51,93.73 141.51,122.56 141.52,122.55 v141.52,123.58
  Bottom 0.254: v141.52,123.58 141.52,126.7 135.91,132.31 83.44,132.31 81.29,130.17 81.29,127.88 U8.P$6
GND  (via drill 0.3, 0.3 pad 0.6, 0.35, 0.35 pad 0.65)
  Top 0.3: U121.3 45.89,51.43 v45.89,50.81
  Top 0.406: R307.2 71.56,34.06 v71.58,34.04
  Top 0.5: U2.21 92.85,57.29 v93.26,57.7 | U7.1 70.71,60.9 v71.84,60.9 | C21.2 62,55.83 v61.98,55.81 | C33.2 63.61,55.84 v63.58,55.81 | X1.4 77.04,53.72 v77.04,52.37 | v67.68,38.84 67.6,38.91 C1.2- 66.43,38.84 v65.18,38.84 | v81.48,45.74 81.05,46.16 L2.1 78.33,45.74 v75.98,45.74 | C7.1 71.68,45.96 v71.68,47.04 | R68.2 87.98,44.8 v87.98,43.74 | C6.1 89.81,48.94 v88.68,48.94 | U28.1 95.39,45.94 v96.18,45.94 | v111.16,36.77 111.2,36.8 C24.2- 111.12,38.84 v110.08,38.84 | R302.1 26.35,83.83 v27.44,83.83 | Q103.2 26.55,85.33 v27.64,85.33 | R238.1 v42.29,49.21 | C14.1 41.17,53.34 v41.09,53.41 | C209.1 53.23,50.78 v53.29,50.71
  Top 0.508: R265.2 115.89,48.07 v115.87,48.05 | R266.2 117.34,48.04 v117.32,48.02 | R267.1 121.7,48.13 v121.68,48.11 | U127.9 121.54,55.33 v121.5,55.37 | C230.1 114.92,59.54 v115,59.47
  other vias: 39.34,33.59 156.49,40.45 37.24,10.85 18.13,10.7 18.44,14.99 49.52,6.05 59.84,15.72 77.87,24.17 56.04,36.49 38.06,25.35 48.93,34.7 81.49,20.78 37.22,23.14 11.57,52.07 111.9,73.92 103.39,83.73 28.84,18.45 28.84,20.45 30.34,21.95 76.52,33.29 63.89,31.6 64.39,28.33 34.64,27.05 116.73,86.68 121.48,86.95 61.75,47.6 27.74,13.15 96.18,47.14 97.08,47.14 97.98,47.14 97.08,45.94 97.98,45.94 96.18,44.94 97.08,44.94 97.98,44.94 65.18,39.84 65.18,37.84 67.68,39.84 67.68,37.74 110.08,39.84 110.08,37.84 111.22,40.87 110.02,36.75 139.89,49.07 136.77,50.91 139.91,51.58 143.18,44.9 118.84,45.96 136.54,53.06 167.47,24.19 75.98,47.84 75.98,46.74 75.98,44.64 81.48,44.64 81.48,46.84 81.48,47.94 76.92,66.3 85.9,68.01 72.88,60.82 71.85,61.99 71.84,59.67 72.87,59.66 74.04,59.6 82.96,62 72.27,55.09 62.41,61.23 77.17,60.98 49.64,34.15 42.83,40.06 13.04,81.57 13.04,90.37 33.43,66.15 28.55,67.87 17.54,26.85 24.64,26.75 13.14,7.25 73.14,55.56 24.54,6.95 61,60.27 82.6,63.17 73.37,66.51 20.64,23.05 45.56,28.73 43.94,20.66 39.26,13.45 44.26,14.45 48.36,14.35 52.99,40.38 57.33,42.1 56.44,46.86 56.86,48.37 55.71,61.62 54.16,116.55 50.14,93.45 32.24,85.1 45.14,97.75 50.26,103.49 25.96,103.39 3.44,109.65 3.64,94.15 2.84,70.85 2.74,38.55 2.64,7.45 32.54,6.65 42.92,5.51 168.47,42.82 159.95,40.19 155.8,42.05 152.89,39.76 65.08,8.12 50.34,11.25 51.06,15.85 46.4,26.26 59.79,24.83 63.59,24.83 55.24,4.25 63.64,1.45 62.78,54.16 78.62,52.46 84.46,53.83 91.2,65.16 85.49,56.24 90.26,59.8 87.89,59.68 90.4,57.1 82.32,53.33 65.77,36.09 109.79,18.18 111.94,8.35 69.88,35.14 63.38,41.34 78.24,28.74 93.92,53.67 83.43,52.85 73.98,40.64 84.68,42.34 125.74,1.45 137.34,7.35 157.78,4.86 186.24,6.65 139.26,41.7 124.82,33.32 143.33,41 109.3,61.73 104.76,54.44 110.09,23.3 118.66,30.92 119.05,38.04 122.45,42.77 122.47,39.3 125.47,34.94 128.71,33.04 186.71,30.1 121.35,33.88 128,47.08 139.76,45.18 187.24,80.55 161.05,91.88 165.85,91.42 186.64,101.55 175.64,75.85 171.14,76.05 180.65,78.95 155.04,71.65 172.55,105.18 154.55,118.38 185.39,132.13 147.44,132.75 115.14,95.76 44.49,48.89 40.59,49.41 41.81,46.2 108.81,134.31 54.94,132.55 13,123.61 54.05,114.2 54.26,118.99 47.9,120.58 54.09,126.2 90.22,66.82 86.72,69.65 92.74,66.02 93.64,55.08 86.98,48.45 82.18,52.27 77.07,59.21 84.5,57.2 105.56,53.49 83.02,46.13 65.25,30.53 47.22,91.2 37.04,63.23 54.4,67.75 66.12,72 72.87,94.54 125.15,71.24 125.62,94.95 123.39,61 76.87,41.98 107.06,61.91 115.1,57.87 113.45,57.48 118.14,59.6 119.41,56.36 122.78,48.02 123.19,57.91 120.9,57.65 118,55.57 137.94,54.34 79.15,68.01 87.49,57.1 84.88,59.71 52.4,61.39 15.24,83.03 137.89,52.43 142.13,53.25 18.6,34.46 133.93,128.13 133.15,95.6 138,50.28 98.75,55.3 100.18,55.25 102.76,58.56 102.54,57.67
  pour Bottom (rank 2, no thermals): -5.11,66.5 -5.11,140.6 -2.61,143.1 184.39,143.1 195.59,131.9 195.99,131.5 195.99,-1 191.79,-5.2 13.99,-5.2 -0.51,-5.2 -3.81,-1.9 -3.81,65.2
  pour Top (rank 2, no thermals): -1.91,-0.2 -1.91,136 2.19,140.1 182.62,140.1 arc-45 186.15,138.63 190.59,134.2 190.59,2.3 185.69,-2.6 0.49,-2.6
  cutout Top: 13.84,123.73 13.84,103.93 46.1,103.93 46.1,123.73
  cutout Bottom: 13.92,123.73 13.92,103.93 46.16,103.93 46.16,123.73
  pour Top (no thermals): 94.83,44.38 94.83,47.28 95.43,47.88 98.33,47.88 98.73,47.48 98.73,44.48 98.03,43.78 95.43,43.78
LIGHT  (via drill 0.3)
  Top 0.254: U127.19 116.99,59.1 v117.1,58.99 | v113.03,55.91 112.07,55.91 R321.2
  Bottom 0.254: v117.1,58.99 115.73,57.62 115.73,57.61 114.03,55.91 v113.03,55.91
N$1
  Top 0.254: U101.3 118.69,78.19 119.19,78.69 119.19,81.7 118.52,82.37 116.8,82.37 R111.1
N$2
  Top 0.254: R321.1 110.53,57.4 R324.1 110.55,59.09 Q108.1
N$3
  Top 0.4: R261.1 R265.1 117.64,52.43 U127.3
N$4
  Top 0.4: R262.1 118.78,50.68 R266.1 118.29,51.62 U127.4
N$5
  Top 0.4: R267.2 121.69,50.68 R263.2 120.24,50.72 118.95,52.01 U127.5
N$6
  Top 0.4: U127.6 119.59,52.95 120.77,51.76 122.62,51.76 123.16,51.22 R264.2
N$7  (via drill 0.3)
  Top 0.254: R268.2 129.35,61.4 134.85,66.9 134.85,85.92 142.98,94.05 142.98,121.47 142.97,121.48 v142.97,122.36
  Bottom 0.254: v142.97,122.36 142.97,126.75 136.59,133.13 75.67,133.13 73.71,131.17 U8.P$3
N$8
  Top 0.254: D13.+ R3.2
N$9
  Top 0.4: U3.4 120.52,42.06 120.19,42.38 118.38,42.38 117.83,41.83 C12.1
N$10
  Top 0.5: C13.1 127.17,42.02 U3.13
N$11
  Top 0.254: U2.7 80.72,54.89 C4.2 80.31,55.29 80.11,55.1 77.96,55.1 X1.3
N$12
  Top 0.254: U2.8 83.17,54.08 80.72,54.08 C3.2 78.94,53.67 X1.1
N$13
  Top 0.254: R111.2 C108.1 119.81,82.36 119.81,77.43 119.3,76.92 U101.4
N$14
  Top 0.5: R4.2 149.23,56.33 R5.1 149.19,57.64 Q1.1
N$15
  Top 0.5: D11.2 143.54,58.64 Q1.3
N$16
  Top 0.5: R7.2 140.91,58.73 D11.1
N$17
  Top 0.254: D14.+ R6.2
N$18
  Top 0.254: U28.2 93.91,47.17 95.27,48.53 R66.1
N$19
  Top 0.5: C2.2 79.33,36.09 L2.2 73.15,36.66 D12.2
  pour Top (no thermals): 85.63,40.88 83.83,40.88 82.53,39.58 70.93,39.58 70.53,39.18 70.53,36.18 72.33,34.38 85.43,34.38 86.13,35.08 86.13,40.38
N$20  (via drill 0.3)
  Top 0.254: Q108.3 111.4,64.78 125.71,64.78 129.3,68.38 129.3,87.17 138.61,96.48 138.61,121.47 138.19,121.89 v138.1,121.89
  Bottom 0.254: v138.1,121.89 137.62,122.37 137.62,126.28 133.65,130.26 107.37,130.26 106.69,129.59 106.69,127.88 U8.P$16
N$21
  Top 0.254: U101.2 R112.2
N$22
  Top 0.254: R17.2 120.39,44.68 U3.2
N$23
  Top 0.254: R1.2 117.91,43.29 U3.3
N$24
  Top 0.254: R11.2 R10.2 103.54,55.44 105.05,56.95 105.05,57.77 104.76,58.06 U6.6
N$25
  Top 0.254: U101.6 115.41,74.38 R110.2
N$26
  Top 0.254: R110.1 C107.1 113.75,75 114.42,75.67 117.85,75.67 U101.5
N$27  (via drill 0.3)
  Top 0.254: U101.12 122,75.65 v120.85,76.81 | v112.34,83.44 v112.33,83.44 C104.2 111.04,83.62 109.54,83.62 | 109.54,83.62 R15.2 | R15.3 108.55,84.6 109.54,83.62
  Bottom 0.254: v120.85,76.81 114.22,83.44 v112.34,83.44
N$28
  Top 0.254: R104.2 113.86,86.5 C104.1 114.56,84.21 115.97,84.21 119.23,84.21 119.96,84.93 R103.2 120.44,84.93 121.42,83.96 121.42,77.79 122.28,76.92 U101.13
N$29
  Top 0.254: R109.2 122.67,71.84 U101.9
N$30
  Top 0.254: U101.10 124.92,73.11 R108.2
N$31
  Top 0.254: 126.74,76.47 C101.2
  Top 0.5: J101.2 106.8,81.39 106.8,86.28 108.37,87.86 124.63,87.86 128.37,84.12 128.37,78.1 126.74,76.47 | R101.2 125.19,76.48 C101.2 126.73,77.84 R102.2
N$32
  Top 0.254: R105.1 126.62,80.99 C105.1 124.91,80.79 123.26,80.79 U101.16 122.34,81.59 C103.2
N$33
  Top 0.254: U101.15 123.21,79.47 C105.2 126.62,79.47 R105.2 127.61,80.42 127.61,81.74 126.81,82.54 R106.2
N$34
  Top 0.254: U121.5 50.24,52.01 R271.2 50.49,50.8 C209.2
N$35
  Top 0.254: C103.1 121.4,85.86 119.26,85.86 118.74,85.34 R103.1
N$36
  Top 0.254: R106.1 125.37,84.06 C106.+
N$37
  Top 0.254: U101.1 117.57,81.03 R113.2
N$38
  Top 0.254: R102.1 124.86,78.19 U101.14
N$39
  Top 0.254: R15.1 R104.1
N$40  (via drill 0.3)
  Top 0.254: C26.1 161.11,40.85 R16.1 | v161.11,42.43 R16.1 | R16.1
  Bottom 0.254: v161.11,42.43 170.08,51.4 170.08,52.91 J9.2
N$41
  Top 0.254: C26.2 159.56,39.15 R20.2 158.53,39.82 U1.5
N$42
  Top 0.254: U1.6 158.47,42.18 157.08,42.18 154.31,39.41 R23.2 R21.2
N$43
  Top 0.254: U1.2 153.3,44.06 U1.1 153.3,46.92 163.26,56.88 163.26,63.6 D1.1
N$44
  Top 0.254: R23.1 151.74,37.78 151.74,41.81 152.17,42.24 U1.3 154.34,42.24 155.61,43.51 U1.7
N$45
  Top 0.254: C29.2 45.6,27.79 47.16,29.35 U4.10
N$46
  Top 0.254: C30.2 50.36,30.05 50.36,34.37 49.31,35.42 48.1,35.42 47.66,34.98 U4.20
N$65
  Top 0.406: 68.78,34.09 R307.1
  Top 0.5: D130.2 68.78,34.09
N$204
  Top 0.5: C15.1 87.35,38.02 U28.6 | U28.6 U28.3 | L1.2 100.68,38.02 U28.6
  pour Top (no thermals): 92.33,46.68 92.33,43.88 91.43,42.98 88.73,42.98 86.73,40.98 86.73,34.58 87.43,33.88 104.03,33.88 104.53,34.38 104.53,38.58 103.63,39.48 98.43,39.48 94.93,42.98 93.83,42.98 93.03,43.78 93.03,46.68
N$258
  Top 0.254: U121.2 43.95,52.01 R237.1 43.81,51.87 R238.2
N$259
  Top 0.254: R274.1 R273.2 49.93,115.7 Q115.1
N$278
  Top 0.5: R299.1 64.99,69.98 J14.P$2
N$279
  Top 0.254: Q103.1 24.81,85.18 R302.2 R284.2
N$280
  Top 0.508: BUZ1.2 17.08,90.68 24.81,90.68 D004.+ 26.2,88.05 Q103.3
N$281
  Top 0.5: R303.2 D004.-
  Top 0.508: BUZ1.1 18.63,87.72 20.2,89.29 D004.-
NC
  Top 1.016: K2.4 27.45,109.48 J123.1
NO
  Top 1.016: J123.3 27.45,116.48 K2.5
RESET  (via drill 0.3)
  Top 0.254: v99.43,69.74 98.72,70.45 90.02,70.45 87.08,67.51 U2.29 87.08,60.08 v86.77,59.77 | v128.32,53.39 128.84,52.87 128.84,51.41 | C13.2 128.84,42.14 128.84,51.41 | SW1.P$3 126.66,52.49 126.66,51.59 | 128.84,51.41 128.76,51.49 126.77,51.49 126.66,51.59 | SW1.P$4 126.65,51.6 | 126.65,51.6 126.59,51.66 126.59,50.53 C23.2 R14.2 | 126.65,51.6 126.66,51.59
  Bottom 0.254: v99.43,69.74 105.11,64.06 105.11,57.16 108.63,53.64 128.07,53.64 v128.32,53.39 | v86.77,59.77 86.77,54.22 83.74,51.19 76.39,51.19 75.63,51.95 66.23,51.95 ICSP.3
RS  (via drill 0.3)
  Top 0.254: U127.13 120.88,61.78 121.31,62.21 129.54,62.21 134.44,67.11 134.44,86.09 142.23,93.88 v142.23,123.07
  Bottom 0.254: v142.23,123.07 142.23,126.56 136.08,132.72 78.16,132.72 76.25,130.81 U8.P$4
SEN_3V3  (via drill 0.3, 0.4)
  Top 0.254: U6.3 100.93,58.07 100.48,58.52 100.48,59.16 99.19,60.45 97.76,60.45 94.99,60.45 | C31.2 48.62,25.14 47.15,25.14 | 47.15,25.14 44.57,25.14 43.9,25.81 43.9,28.47 44.8,29.37 45.95,29.37 46.12,29.54 U4.8 | 47.15,25.14 47.15,28.15 48.97,29.97 U4.13 | C14.2 44.66,52.51 U121.1
  Top 0.4: R237.2 43.76,53.34 C14.2
  Top 0.406: R271.1 52.01,52.29 50.64,53.66 44.15,53.66 C14.2
  Top 0.5: 96.97,56.69 C17.1 | R12.1
  Top 0.6: C22.1 74.05,52.32 | 95.65,53.99 94.25,52.59 92.81,52.59 90.08,49.86 76.5,49.86 74.05,52.32 | 95.65,53.99 96.97,55.31 96.97,56.69 | C17.1 R12.1 | R11.1 95.65,53.99 | 108.17,68.26 106.99,68.26 C102.2 102.91,68.37 94.99,60.45 | 108.17,68.26 R109.1 117.57,71.54 U101.8 119.57,71.84 122.11,74.38 U101.11 | R113.1 113.6,80.7 108.78,75.88 J101.1 108.37,75.5 108.37,68.47 108.17,68.26 | 74.05,52.32 59.58,52.32 v59.54,52.36 | C31.2 53.92,26.24 59.42,31.74 v59.42,43.5 v59.43,43.51 | R12.1 96.95,59.64 R13.1 97.76,60.45 | R271.1 56.84,52.26 v56.94,52.36
  Top 0.813: C22.1 C34.1 70.59,56.9 U7.4 U7.2
  Bottom 0.6: v59.43,43.51 v59.44,43.52 59.44,52.26 v59.54,52.36 v56.94,52.36
  pour Top (no thermals): 67.63,60.56 67.63,59.36 67.13,58.86 65.43,58.86 65.03,58.46 65.03,54.36 66.03,53.36 70.53,53.36 71.53,54.36 71.53,58.46 71.13,58.86 69.43,58.86 68.93,59.36 68.93,60.66 68.63,60.96 68.03,60.96
USB_DN  (via drill 0.3)
  Top 0.254: U3.6 119.33,39.48 v118.84,39.97
  Bottom 0.254: J6.1 127.82,39.5 127.35,39.97 v118.84,39.97 116.73,39.97 J8.3
USB_DP  (via drill 0.3)
  Top 0.254: U3.5 119.64,40.75 118.82,41.57 v118.82,41.6
  Bottom 0.254: J8.2 117.1,41.6 v118.82,41.6 126.67,41.6 J5.1
V+
  Top 0.508: R276.2 45.63,106.98 K2.1
V-
  Top 0.504: 47.06,118.98 47.26,118.98 48.29,117.95 | D003.+ 49.44,118.9 Q115.3
  Top 0.508: 48.29,117.95 D003.+ | K2.3 47.06,118.98
VCC_5V  (via drill 0.3)
  Top 0.254: U6.7 104.94,58.57 105.92,57.6 108.02,57.6 | v145.39,79.77 145.39,80.88 145.44,80.93 | v145.35,80.84 145.35,81.92 v145.32,81.95
  Top 0.5: D12.1 C7.2 | C7.2 | R67.1 C66.2 84.13,45.79 84.13,47.38 82.65,48.86 74.97,48.86 72.77,46.67 72.77,44.94 72.24,44.41 C7.2 | 123.94,47.61 123.94,48.37 | 123.59,47.26 123.63,47.23 C20.1 125.47,47.2 U3.16 | 114.42,48.03 R261.2 114.27,49.16 113.28,50.14 | R262.2 118.79,46.91 | R263.1 120.24,47.65 | 113.28,52.79 114.29,53.8 | 114.29,53.8 117.8,57.31 | C230.2 113.89,61.09 U127.20 116.33,58.49 117.51,57.31 117.8,57.31 | 132.73,59.39 119.88,59.39 117.8,57.31 | 114.29,53.8 109.18,53.8 108.02,54.96 C18.2 108.02,57.6 108.02,58.36 R2.1 108.04,58.4 R9.1 | D130.1 62.15,34.09 61.97,34.28 | U7.3
  Top 0.508: 113.28,52.79 113.28,50.14 | 114.42,48.03 115.54,46.91 118.79,46.91 120.25,46.91 | 120.25,46.91 123.24,46.91 123.59,47.26 123.94,47.61 | 123.94,48.37 R264.1 | 120.24,47.65 120.24,46.92 120.25,46.91 | C20.1 125.43,48.67 R14.1
  Top 0.6: C35.2 51.88,106.36 L11.1 | R7.1 135.16,58.32 135.16,60.18 | C5.2 80.82,58.31 81.84,57.29 | 81.84,57.29 81.84,56 82.15,55.69 U2.6 | U2.4 81.84,57.29
  Top 0.61: U2.18 84.92,54.89 84.12,55.69 U2.6 | R303.1 C19.1 22.9,83.71 23.9,82.7 23.9,79.89 43.87,59.93 58.32,59.93
  Top 0.8: U5.1 28.61,29.56 31.43,29.56 C37.2 31.81,30.02 33.35,31.57 R18.1 33.36,32.58 R19.1 33.36,42.22 36.03,44.89 | C25.2 P1.3 | U1.8 158.57,44.82 161.34,44.82 162.81,43.35 R16.2 167.86,41.24 173.72,35.38 U309.1 C214.2 173.72,23.21 170.27,19.76 | J13.2 117.07,28.82 117.07,28.91 116.32,29.65 R6.1 114.86,33.51 113.86,34.51 113.86,36.71 115.07,37.92 R3.1 | U7.3 C33.1 C21.1 58.34,58.42 58.32,58.44 | 58.32,63.1 78.37,63.1 79.98,61.49 C9.2 79.97,61.2 C11.2 79.97,58.32 C5.2 | 168.11,67.18 145.38,67.18 138.38,60.18 135.16,60.18 133.52,60.18 132.73,59.39 131.84,58.5 R268.3 | R301.1 170.27,19.76 | R8.1 136.27,14.4 | 170.27,19.76 170.27,14.41 170.34,14.35 | 146.45,80.93 145.44,80.93 v145.35,80.84 | D12.1 69.9,43.91 C1.1+
  Top 0.813: L11.1 56.94,112.67 56.94,121 60.85,124.91 71.01,124.91 71.17,125.07 71.17,125.66
  Top 1: 71.92,14.35 71.38,14.88 J11.2 J1.2 | 93.62,14.35 93.99,14.72 J10.2 J12.2 | 117.78,14.35 117.84,14.41 J2.2 117.84,28.05 J13.2
  Top 1.27: C1.1+ 64.03,43.91 61.97,41.86 61.97,34.28 61.97,17.86 65.48,14.35 71.92,14.35 93.62,14.35 117.78,14.35 136.22,14.35 | C25.2 180.75,68.17 176.56,63.98 176.56,58.72 | 176.56,58.72 176.56,17.59 173.32,14.35 170.34,14.35 136.22,14.35 | 58.32,44.89 65.53,44.89 C1.1+ | 58.32,44.89 36.03,44.89 | 58.32,44.89 58.32,58.44 58.32,59.93 58.32,63.1 58.32,68.44 J14.P$4 | 176.56,58.72 168.11,67.18 159.1,76.18 148.9,76.18 146.45,78.63 146.45,80.93 146.45,120.55 142.17,124.83 104.68,124.83 | 104.68,124.83 72,124.83 71.17,125.66 U8.P$2 | 104.68,124.83 104.68,127.36 U8.P$15 | C1.1+ 69.35,46.76 ICSP.6 | 136.27,14.4 136.22,14.35
  Bottom 1.27: J3.3 145.79,81.28 v145.35,80.84
  pour Top (no thermals): 64.63,45.48 70.13,45.48 70.53,45.08 72.63,45.08 73.13,44.58 73.13,41.18 72.63,40.68 69.83,40.68 68.43,42.08 64.43,42.08 64.13,42.38 64.13,44.98
  pour Top: 144.73,82.66 144.73,79.46 145.8,78.39 146.24,78.39 146.63,78.78 146.63,83.42 146.33,83.72 145.79,83.72
  pour Bottom: 144.72,82.27 144.72,79.47 145.77,78.42 146.58,78.42 146.82,78.66 146.82,82.21 146.52,82.51 144.96,82.51
VCC_RELAY
  Top 0.5: L11.2 49.88,108.89 C36.2 51.62,110.62 R276.1 50.44,112.62 48.85,112.62 48.29,113.18 D003.-
VFB
  Top 0.5: U28.5 89.41,46.41 R68.1 R67.2 C66.1
VIN  (via drill 0.3)
  Top 0.61: L1.1 107.25,46.16 109.53,43.88 111.17,43.88 C24.1+
  Bottom 1.27: J4.1 125.3,45.57 123.78,44.06 J8.1 113.59,44.06 v113.25,44.4
  other vias: 112.28,45.54 113.24,45.54 112.26,44.44 112.19,43.28 113.23,43.22
  pour Top (no thermals): 90.93,44.08 90.93,49.56 92.64,51.27 104.94,51.27 110.01,46.2 113.74,46.2 113.74,42.28 107.63,42.28 106.43,43.48 99.53,43.48 99.13,43.88 99.13,48.18 97.53,49.78 94.73,49.78 94.33,49.38 94.33,48.38 94.13,48.18 92.43,48.18 91.83,47.58 91.83,44.08 91.73,43.98 91.03,43.98
  pour Bottom: 111.57,46.19 111.57,42.29 113.77,42.29 114.45,42.97 114.45,45.53 113.8,46.18 111.58,46.18

### Text on the board
tPlace: A4/SDA | A5/SCL | D4 | NO | COM | NC | Relay | LCD | ADD:0X21 | D3 | D9 | Servo / Motor | EC-D5 | A2 | TR-D6 | A0 | Buzzer | Linear Potentiometer | PIR | Ultrasonic Ranging | D10 | A1 | A4/SDA | A5/SCL | ADD:0X5C | LED | Reset | Light | A4/SDA | A5/SCL | Sound | ADD:0X38 | PWR | D2 | D7 | Button | A | A | D | G | 5V | A3 | G | 5V | A6 | G | 5V | D11 | Temperature | 3-Axis | A4/SDA | ADD:0X68 | A5/SCL | & Humidity | I2C | I2C | UART | IR | G | 5V | SDA | SCL | G | 5V | SDA | SCL | G | 5V | TX | RX | All_in_one Starter Kit for Arduino
bPlace: V1.0